# EAGLE design as3320-Vowel-1 (EAGLE 9.6.2)

## Sheet 1 of 5: CEM
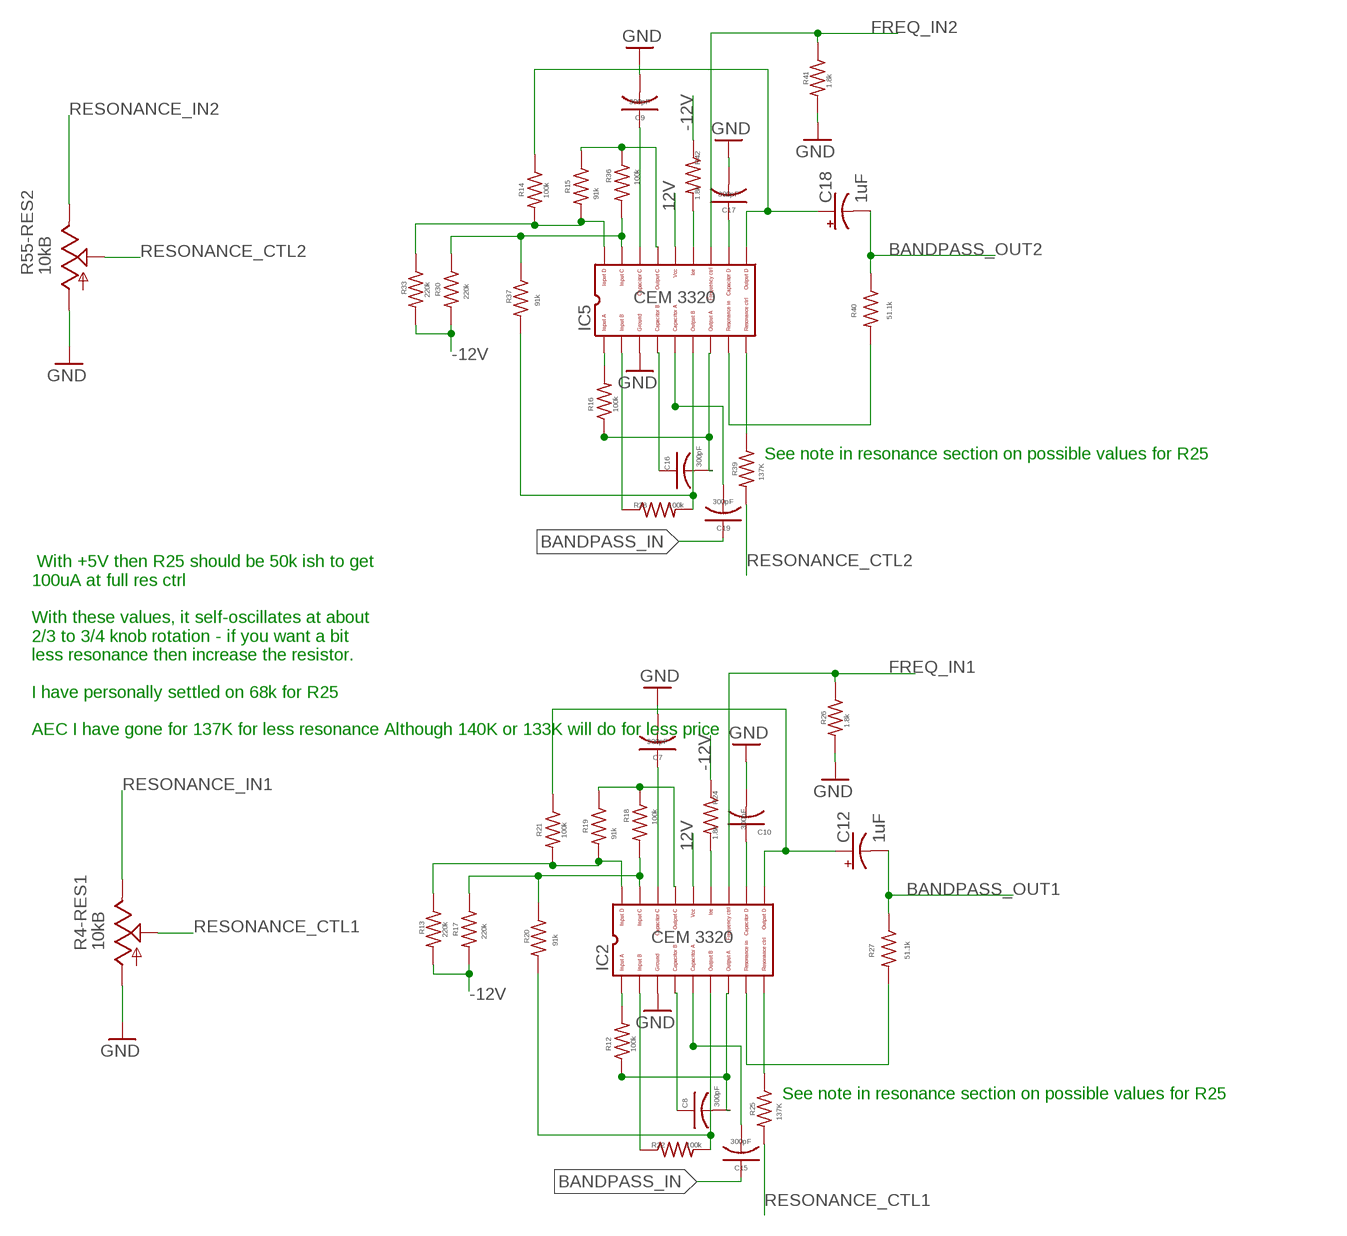
[diagram p0: schematic, sheet 1, part 1 of 2]
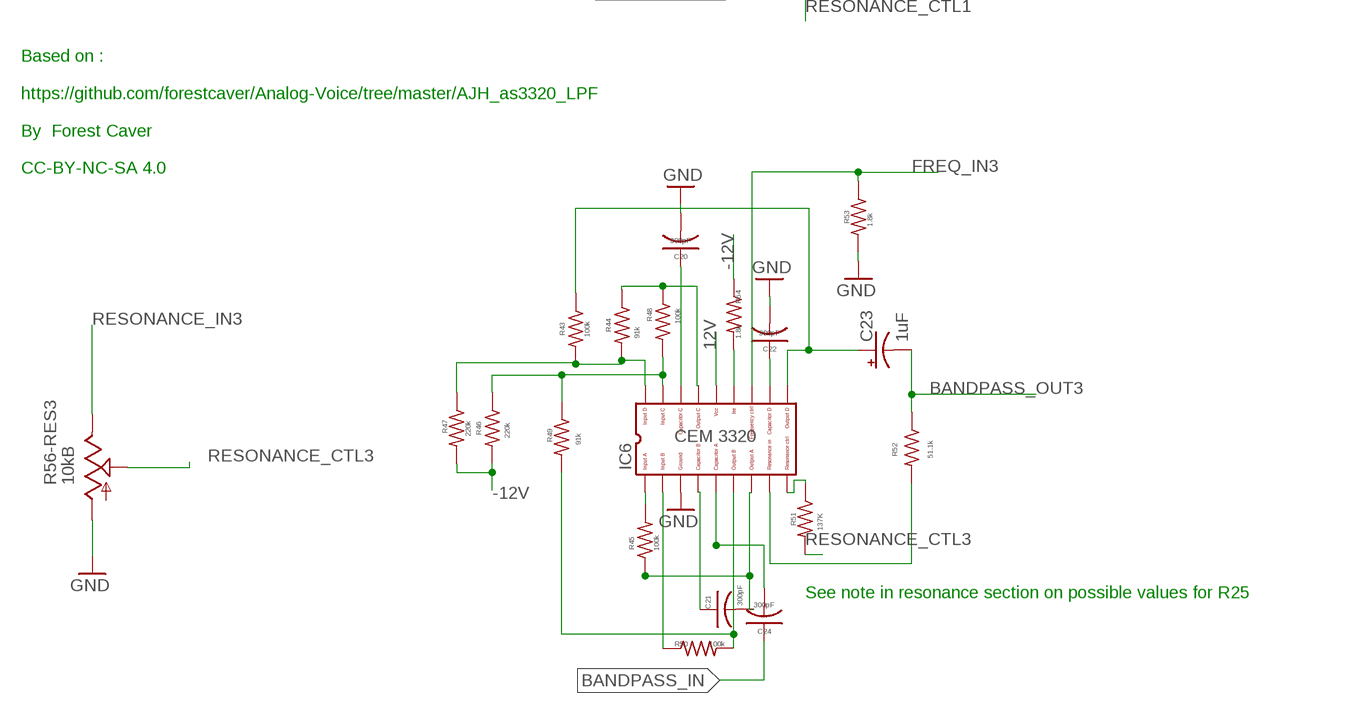
[diagram p1: schematic, sheet 1, part 2 of 2]

### Parts
C7  300pF  C-USC0805K  [C0805K]
C8  300pF  C-USC0805K  [C0805K]
C9  300pF  C-USC0805K  [C0805K]
C10  300pF  GMSN_C-USC0805K  [GMSN_C0805K]
C12  1uF  CPOL-USB  [PANASONIC_B]
C15  300pF  C-USC0805K  [C0805K]
C16  300pF  C-USC0805K  [C0805K]
C17  300pF  C-USC0805K  [C0805K]
C18  1uF  CPOL-USB  [PANASONIC_B]
C19  300pF  C-USC0805K  [C0805K]
C20  300pF  C-USC0805K  [C0805K]
C21  300pF  C-USC0805K  [C0805K]
C22  300pF  C-USC0805K  [C0805K]
C23  1uF  CPOL-USB  [PANASONIC_B]
C24  300pF  GMSN_C-USC0805K  [GMSN_C0805K]
IC2  CEM3320  [DIL18]
IC5  CEM3320  [DIL18]
IC6  CEM3320  [DIL18]
R4-RES1  10kB  POT_USVERTICAL  [ALPS_POT_VERTICAL]
R12  100k  GMSN_R-US_M0805  [GMSN_M0805]
R13  220k  GMSN_R-US_M0805  [GMSN_M0805]
R14  100k  GMSN_R-US_M0805  [GMSN_M0805]
R15  91k  GMSN_R-US_M0805  [GMSN_M0805]
R16  100k  GMSN_R-US_M0805  [GMSN_M0805]
R17  220k  GMSN_R-US_M0805  [GMSN_M0805]
R18  100k  GMSN_R-US_M0805  [GMSN_M0805]
R19  91k  GMSN_R-US_M0805  [GMSN_M0805]
R20  91k  GMSN_R-US_M0805  [GMSN_M0805]
R21  100k  GMSN_R-US_M0805  [GMSN_M0805]
R22  100k  GMSN_R-US_M0805  [GMSN_M0805]
R24  1.8k  GMSN_R-US_M0805  [GMSN_M0805]
R25  137K  GMSN_R-US_M0805  [GMSN_M0805]
R26  1.8k  GMSN_R-US_M0805  [GMSN_M0805]
R27  51.1k  GMSN_R-US_M0805  [GMSN_M0805]
R30  220k  GMSN_R-US_M0805  [GMSN_M0805]
R33  220k  GMSN_R-US_M0805  [GMSN_M0805]
R36  100k  GMSN_R-US_M0805  [GMSN_M0805]
R37  91k  GMSN_R-US_M0805  [GMSN_M0805]
R38  100k  GMSN_R-US_M0805  [GMSN_M0805]
R39  137K  GMSN_R-US_M0805  [GMSN_M0805]
R40  51.1k  GMSN_R-US_M0805  [GMSN_M0805]
R41  1.8k  GMSN_R-US_M0805  [GMSN_M0805]
R42  1.8k  GMSN_R-US_M0805  [GMSN_M0805]
R43  100k  GMSN_R-US_M0805  [GMSN_M0805]
R44  91k  GMSN_R-US_M0805  [GMSN_M0805]
R45  100k  GMSN_R-US_M0805  [GMSN_M0805]
R46  220k  GMSN_R-US_M0805  [GMSN_M0805]
R47  220k  GMSN_R-US_M0805  [GMSN_M0805]
R48  100k  GMSN_R-US_M0805  [GMSN_M0805]
R49  91k  GMSN_R-US_M0805  [GMSN_M0805]
R50  100k  GMSN_R-US_M0805  [GMSN_M0805]
R51  137K  GMSN_R-US_M0805  [GMSN_M0805]
R52  51.1k  GMSN_R-US_M0805  [GMSN_M0805]
R53  1.8k  GMSN_R-US_M0805  [GMSN_M0805]
R54  1.8k  GMSN_R-US_M0805  [GMSN_M0805]
R55-RES2  10kB  POT_USVERTICAL  [ALPS_POT_VERTICAL]
R56-RES3  10kB  POT_USVERTICAL  [ALPS_POT_VERTICAL]

### Nets
12V [power]: IC2.14 IC5.14 IC6.14 ; also sheet 2,3,5
-12V [power]: R13.2 R17.2 R24.1 R30.2 R33.2 R42.1 R46.2 R47.2 R54.1 ; also sheet 2,3,5
BANDPASS_IN: C15.1 C19.1 C24.1 ; also sheet 3
BANDPASS_OUT1: C12.- R27.1 ; also sheet 5
BANDPASS_OUT2: C18.- R40.1 ; also sheet 5
BANDPASS_OUT3: C23.- R52.1 ; also sheet 5
FREQ_IN1: IC2.12 R26.1 ; also sheet 3
FREQ_IN2: IC5.12 R41.1 ; also sheet 3
FREQ_IN3: IC6.12 R53.1 ; also sheet 3
GND [power]: C7.2 C9.2 C10.2 C17.2 C20.2 C22.2 IC2.3 IC5.3 IC6.3 R4-RES1.P$3(A) R26.2 R41.2 R53.2 R55-RES2.P$3(A) R56-RES3.P$3(A) ; also sheet 2,3,4,5
N$2: IC2.17 R17.1 R18.2 R20.1
N$14: IC2.15 R18.1 R19.1
N$16: IC2.18 R13.1 R19.2 R21.2
N$17 [nearfilter]: C12.+ IC2.10 R21.1
N$18 [nearfilter]: C17.1 IC5.11
N$19: C15.2 IC2.5
N$21: IC5.9 R39.1
N$23: C8.2 IC2.7 R12.1
N$24: C8.1 IC2.4
N$25: IC2.2 R22.1
N$26: IC2.6 R20.2 R22.2
N$27: IC2.1 R12.2
N$28 [nearfilter]: IC5.8 R40.2
N$29 [nearfilter]: IC5.13 R42.2
N$30: C9.1 IC5.16
N$31 [nearfilter]: C18.+ IC5.10 R14.1
N$32: C19.2 IC5.5
N$33: C16.2 IC5.7 R16.1
N$34: C16.1 IC5.4
N$35: IC5.2 R38.1
N$36: IC5.6 R37.2 R38.2
N$37: IC5.1 R16.2
N$38: IC5.17 R30.1 R36.2 R37.1
N$40: C7.1 IC2.16
N$41: IC5.15 R15.1 R36.1
N$42: IC5.18 R14.2 R15.2 R33.1
N$43 [nearfilter]: C10.1 IC2.11
N$44: IC2.9 R25.1
N$45 [nearfilter]: C22.1 IC6.11
N$46: IC6.9 R51.1
N$47 [nearfilter]: IC6.8 R52.2
N$48 [nearfilter]: IC6.13 R54.2
N$49: C20.1 IC6.16
N$50 [nearfilter]: C23.+ IC6.10 R43.1
N$51 [nearfilter]: IC2.8 R27.2
N$52: C24.2 IC6.5
N$53: C21.2 IC6.7 R45.1
N$54 [nearfilter]: IC2.13 R24.2
N$56: C21.1 IC6.4
N$57: IC6.2 R50.1
N$58: IC6.6 R49.2 R50.2
N$59: IC6.1 R45.2
N$60: IC6.17 R46.1 R48.2 R49.1
N$61: IC6.15 R44.1 R48.1
N$62: IC6.18 R43.2 R44.2 R47.1
RESONANCE_CTL1: R4-RES1.P$2(S) R25.2
RESONANCE_CTL2: R39.2 R55-RES2.P$2(S)
RESONANCE_CTL3: R51.2 R56-RES3.P$2(S)
RESONANCE_IN1: R4-RES1.P$1(E) ; also sheet 3
RESONANCE_IN2: R55-RES2.P$1(E) ; also sheet 3
RESONANCE_IN3: R56-RES3.P$1(E) ; also sheet 3

### Notes on the sheet
- See note in resonance section on possible values for R25
- With +5V then R25 should be 50k ish to get
  100uA at full res ctrl
  
  With these values, it self-oscillates at about
  2/3 to 3/4 knob rotation - if you want a bit
  less resonance then increase the resistor.
  
  I have personally settled on 68k for R25
  
  AEC I have gone for 137K for less resonance Although 140K or 133K will do for less price
- See note in resonance section on possible values for R25
- Based on :
  
  https://github.com/forestcaver/Analog-Voice/tree/master/AJH_as3320_LPF
  
  By  Forest Caver
  
  CC-BY-NC-SA 4.0
- See note in resonance section on possible values for R25

## Sheet 2 of 5: Power
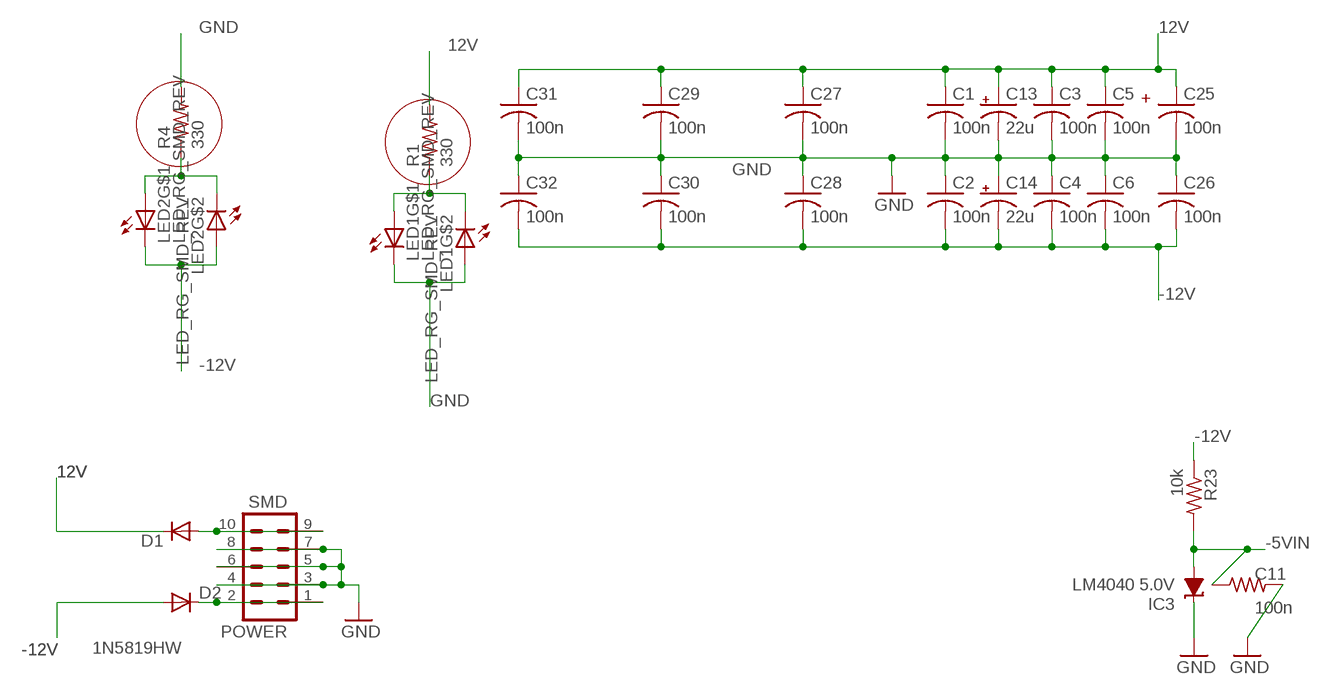
[diagram p2: schematic, sheet 2]

### Parts
C1  100n  C-USC0805K  [C0805K]
C2  100n  C-USC0805K  [C0805K]
C3  100n  C-USC0805K  [C0805K]
C4  100n  C-USC0805K  [C0805K]
C5  100n  C-USC0805K  [C0805K]
C6  100n  C-USC0805K  [C0805K]
C11  100n  GMSN_R-US_M0805  [GMSN_M0805]
C13  22u  CPOL-USB  [PANASONIC_B]
C14  22u  CPOL-USB  [PANASONIC_B]
C25  100n  C-USC0805K  [C0805K]
C26  100n  C-USC0805K  [C0805K]
C27  100n  C-USC0805K  [C0805K]
C28  100n  C-USC0805K  [C0805K]
C29  100n  C-USC0805K  [C0805K]
C30  100n  C-USC0805K  [C0805K]
C31  100n  C-USC0805K  [C0805K]
C32  100n  C-USC0805K  [C0805K]
D1  1N5819HW  DIODE-SOD123  [SOD123]
D2  1N5819HW  DIODE-SOD123  [SOD123]
IC3  LM4040 5.0V  LM4041C12DBZ  [DBZ_R-PDSO-G3]
LED1  LED_RG_SMD_REV  [LSG_T77K]
LED2  LED_RG_SMD_REV  [LSG_T77K]
POWER  SMD  CONN_05X2SHD_SMD  [2X5-SHROUDED_SMD]
R1  330  GMSN_R-US_M0805  [GMSN_M0805]
R4  330  GMSN_R-US_M0805  [GMSN_M0805]
R23  10k  GMSN_R-US_M0805  [GMSN_M0805]

### Nets
12V [power]: C1.1 C3.1 C5.1 C13.+ C25.1 C27.1 C29.1 C31.1 D1.C R1.2 ; also sheet 1,3,5
-5VIN [power]: C11.1 IC3.2(A) R23.2 ; also sheet 4
-12V [power]: C2.2 C4.2 C6.2 C14.- C26.2 C28.2 C30.2 C32.2 D2.A LED2.1(C) LED2.4(A) R23.1 ; also sheet 1,3,5
-12V-P: D2.C POWER.1 POWER.2
GND [power]: C1.2 C2.1 C3.2 C4.1 C5.2 C6.1 C11.2 C13.- C14.+ C25.2 C26.1 C27.2 C28.1 C29.2 C30.1 C31.2 C32.1 IC3.1(C) LED1.1(C) LED1.4(A) POWER.3 POWER.4 POWER.5 POWER.6 POWER.7 POWER.8 R4.2 ; also sheet 1,3,4,5
N$6: D1.A POWER.9 POWER.10
N$74: LED2.2(A) LED2.3(C) R4.1
N$75: LED1.2(A) LED1.3(C) R1.1

### Notes on the sheet
- +

## Sheet 3 of 5: Input
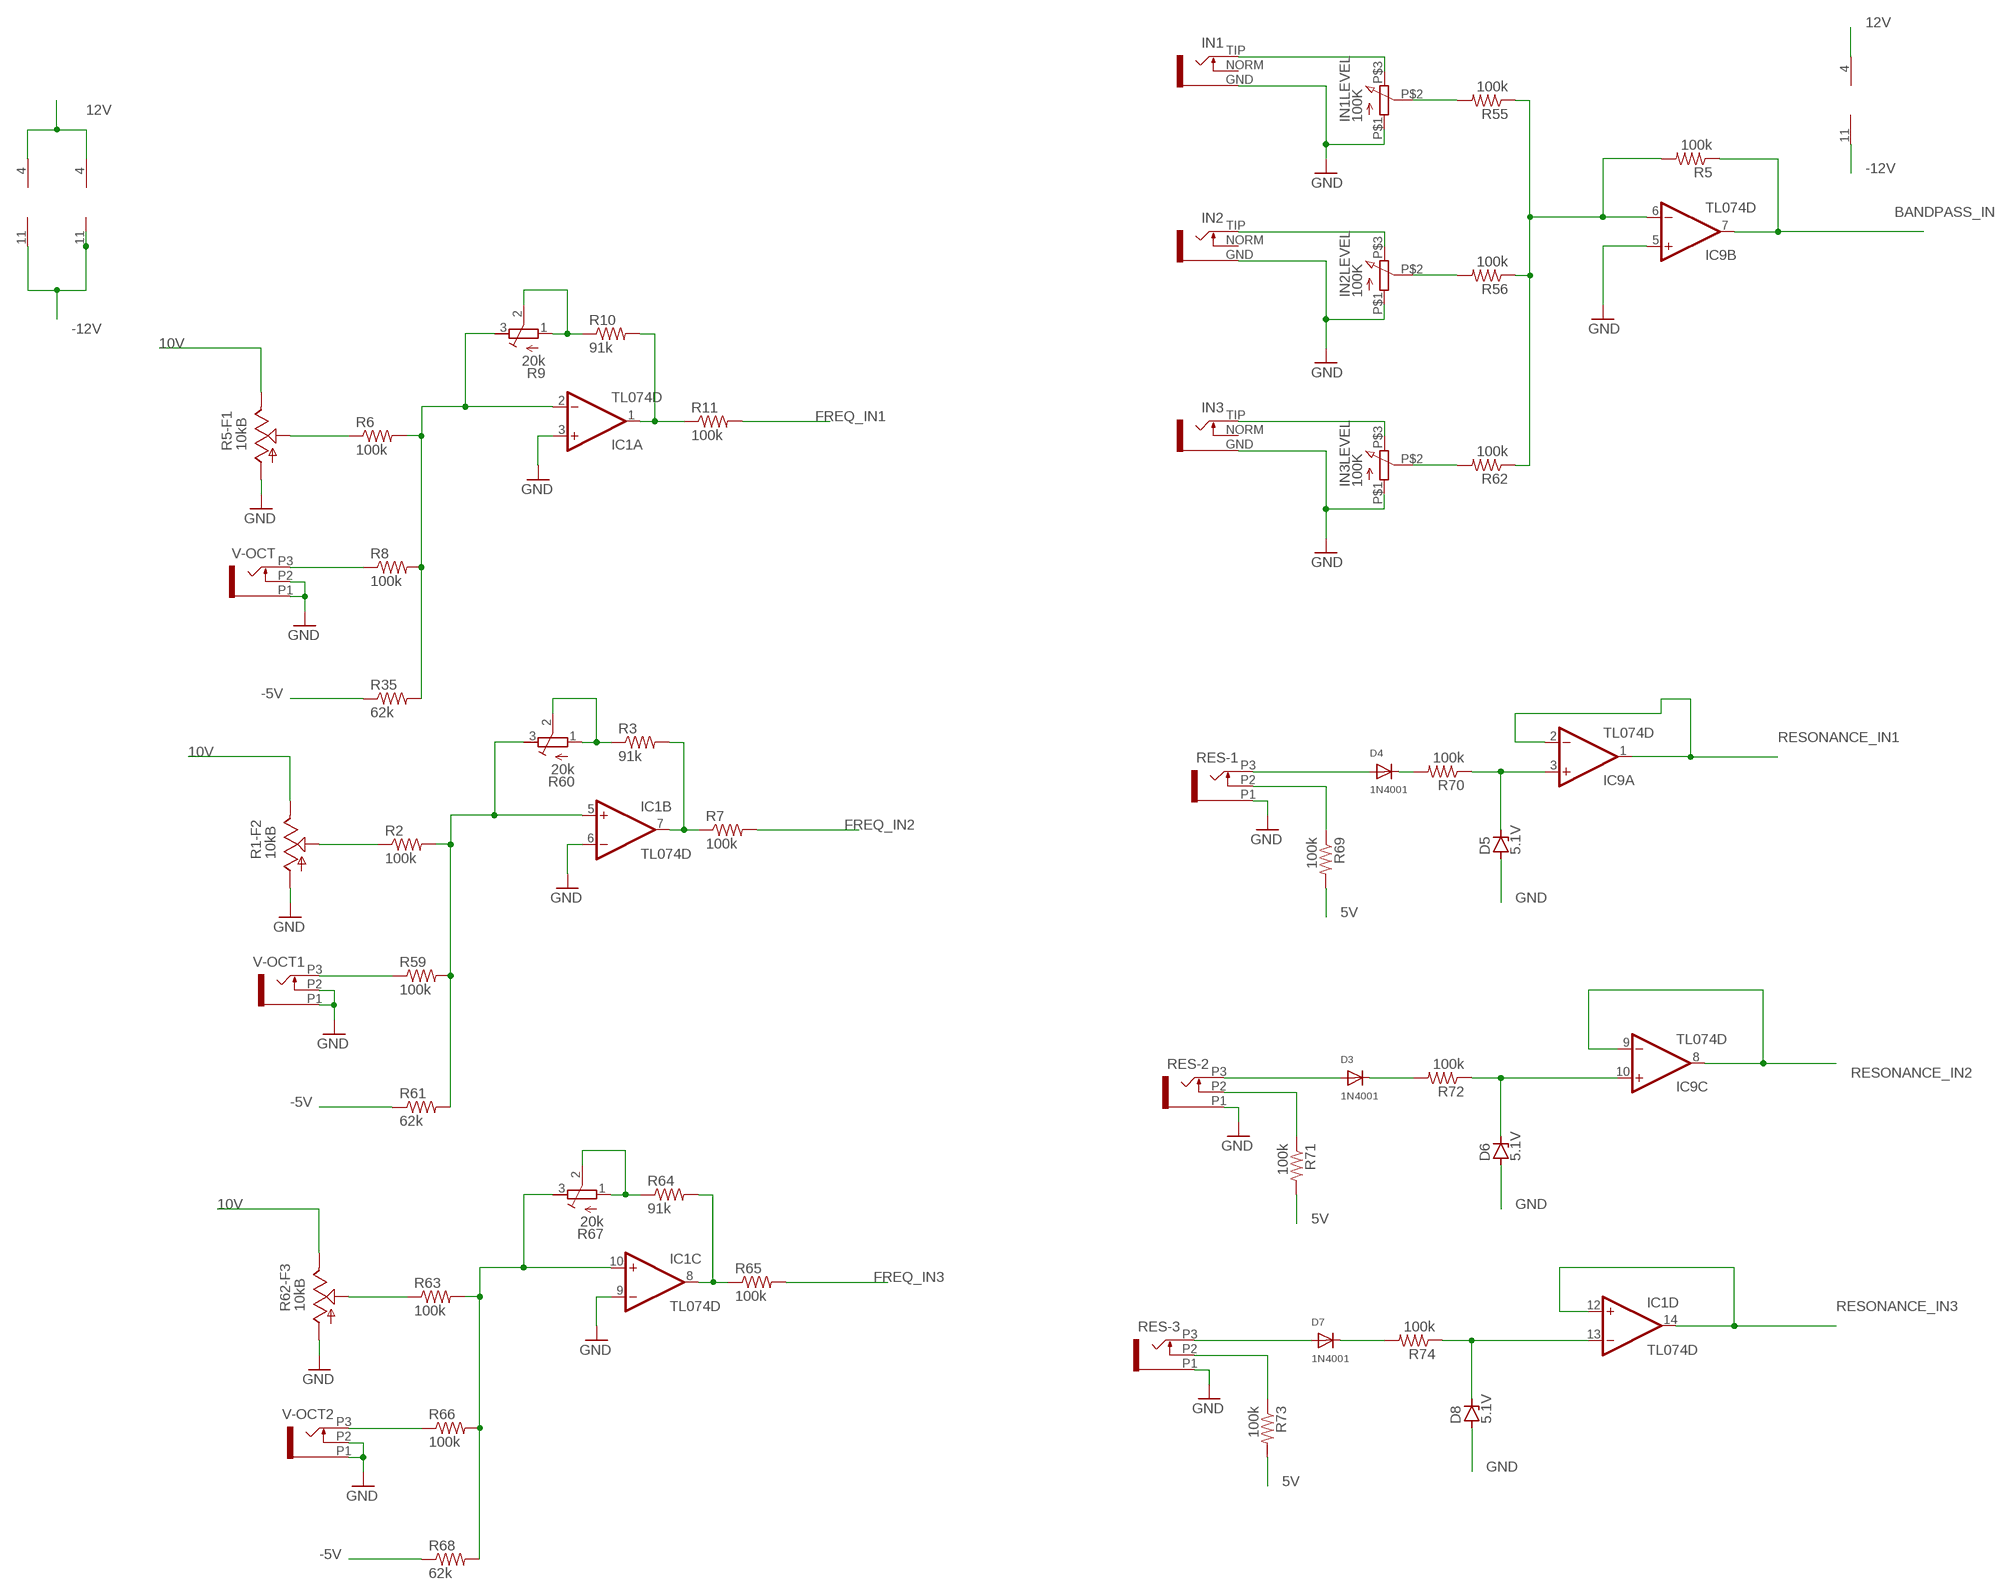
[diagram p3: schematic, sheet 3]

### Parts
D3  1N4001  DIODESMA  [SMADIODE]
D4  1N4001  DIODESMA  [SMADIODE]
D5  5.1V  ZENER-DIODESOT23  [SOT23]
D6  5.1V  ZENER-DIODESOT23  [SOT23]
D7  1N4001  DIODESMA  [SMADIODE]
D8  5.1V  ZENER-DIODESOT23  [SOT23]
IC1  TL074D  [SO14]
IC4  TL074D  [SO14]
IC9  TL074D  [SO14]
IN1  S_JACK  [S_JACK]
IN1LEVEL  100K  9MMPOT  [POT]
IN2  S_JACK  [S_JACK]
IN2LEVEL  100K  9MMPOT  [POT]
IN3  S_JACK  [S_JACK]
IN3LEVEL  100K  9MMPOT  [POT]
R1-F2  10kB  POT_USVERTICAL  [ALPS_POT_VERTICAL]
R2  100k  GMSN_R-US_M0805  [GMSN_M0805]
R3  91k  GMSN_R-US_M0805  [GMSN_M0805]
R5  100k  GMSN_R-US_M0805  [GMSN_M0805]
R5-F1  10kB  POT_USVERTICAL  [ALPS_POT_VERTICAL]
R6  100k  GMSN_R-US_M0805  [GMSN_M0805]
R7  100k  GMSN_R-US_M0805  [GMSN_M0805]
R8  100k  GMSN_R-US_M0805  [GMSN_M0805]
R9  20k  R-TRIMM3296X  [RTRIM3296X]
R10  91k  GMSN_R-US_M0805  [GMSN_M0805]
R11  100k  GMSN_R-US_M0805  [GMSN_M0805]
R35  62k  GMSN_R-US_M0805  [GMSN_M0805]
R55  100k  R-US_R0805  [R0805]
R56  100k  R-US_R0805  [R0805]
R59  100k  GMSN_R-US_M0805  [GMSN_M0805]
R60  20k  R-TRIMM3296X  [RTRIM3296X]
R61  62k  GMSN_R-US_M0805  [GMSN_M0805]
R62  100k  R-US_R0805  [R0805]
R62-F3  10kB  POT_USVERTICAL  [ALPS_POT_VERTICAL]
R63  100k  GMSN_R-US_M0805  [GMSN_M0805]
R64  91k  GMSN_R-US_M0805  [GMSN_M0805]
R65  100k  GMSN_R-US_M0805  [GMSN_M0805]
R66  100k  GMSN_R-US_M0805  [GMSN_M0805]
R67  20k  R-TRIMM3296X  [RTRIM3296X]
R68  62k  GMSN_R-US_M0805  [GMSN_M0805]
R69  100k  R-US_R0805  [R0805]
R70  100k  GMSN_R-US_M0805  [GMSN_M0805]
R71  100k  R-US_R0805  [R0805]
R72  100k  GMSN_R-US_M0805  [GMSN_M0805]
R73  100k  R-US_R0805  [R0805]
R74  100k  R-US_R0805  [R0805]
RES-1  PJ301_THONKICONN6  [WQP_PJ_301M6]
RES-2  PJ301_THONKICONN6  [WQP_PJ_301M6]
RES-3  PJ301_THONKICONN6  [WQP_PJ_301M6]
V-OCT  PJ301_THONKICONN6  [WQP_PJ_301M6]
V-OCT1  PJ301_THONKICONN6  [WQP_PJ_301M6]
V-OCT2  PJ301_THONKICONN6  [WQP_PJ_301M6]

### Nets
5V [power]: R69.2 R71.2 R73.2 ; also sheet 4
10V [power]: R1-F2.P$1(E) R5-F1.P$1(E) R62-F3.P$1(E) ; also sheet 4
12V [power]: IC1.4(P:V+) IC4.4(P:V+) IC9.4(P:V+) ; also sheet 1,2,5
-5V [power]: R35.1 R61.1 R68.1 ; also sheet 4
-12V [power]: IC1.11(P:V-) IC4.11(P:V-) IC9.11(P:V-) ; also sheet 1,2,5
BANDPASS_IN: IC9.7(B:OUT) R5.1 ; also sheet 1
FREQ_IN1: R11.2 ; also sheet 1
FREQ_IN2: R7.2 ; also sheet 1
FREQ_IN3: R65.2 ; also sheet 1
GND [power]: D5.1(A) D6.1(A) D8.1(A) IC1.3(A:+IN) IC1.6(B:-IN) IC1.9(C:-IN) IC9.5(B:+IN) IN1.GND IN1LEVEL.P$1 IN2.GND IN2LEVEL.P$1 IN3.GND IN3LEVEL.P$1 R1-F2.P$3(A) R5-F1.P$3(A) R62-F3.P$3(A) RES-1.P1 RES-2.P1 RES-3.P1 V-OCT1.P1 V-OCT1.P2 V-OCT2.P1 V-OCT2.P2 V-OCT.P1 V-OCT.P2 ; also sheet 1,2,4,5
N$3: IC1.7(B:OUT) R3.2 R7.1
N$4: R5-F1.P$2(S) R6.1
N$5: R1-F2.P$2(S) R2.1
N$7: IC1.2(A:-IN) R6.2 R8.2 R9.3(A) R35.2
N$8: IC1.1(A:OUT) R10.2 R11.1
N$9: R71.1 RES-2.P2
N$10: R8.1 V-OCT.P3
N$12: IC1.5(B:+IN) R2.2 R59.2 R60.3(A) R61.2
N$55: R9.1(E) R9.2(S) R10.1
N$67: R59.1 V-OCT1.P3
N$68: R3.1 R60.1(E) R60.2(S)
N$69: IC1.8(C:OUT) R64.2 R65.1
N$70: R62-F3.P$2(S) R63.1
N$71: IC1.10(C:+IN) R63.2 R66.2 R67.3(A) R68.2
N$72: R66.1 V-OCT2.P3
N$73: R64.1 R67.1(E) R67.2(S)
N$76: IN1.TIP IN1LEVEL.P$3
N$77: IN2.TIP IN2LEVEL.P$3
N$78: D3.A RES-2.P3
N$79: IN1LEVEL.P$2 R55.2
N$80: IN2LEVEL.P$2 R56.2
N$81: R69.1 RES-1.P2
N$82: IN3.TIP IN3LEVEL.P$3
N$83: IN3LEVEL.P$2 R62.2
N$84: IC9.6(B:-IN) R5.2 R55.1 R56.1 R62.1
N$85: D3.C R72.2
N$86: D4.A RES-1.P3
N$87: D4.C R70.2
N$88: D5.3(C) IC9.3(A:+IN) R70.1
N$89: D6.3(C) IC9.10(C:+IN) R72.1
N$90: R73.1 RES-3.P2
N$91: D7.A RES-3.P3
N$92: D7.C R74.2
N$93: D8.3(C) IC1.13(D:-IN) R74.1
RESONANCE_IN1: IC9.1(A:OUT) IC9.2(A:-IN) ; also sheet 1
RESONANCE_IN2: IC9.8(C:OUT) IC9.9(C:-IN) ; also sheet 1
RESONANCE_IN3: IC1.12(D:+IN) IC1.14(D:OUT) ; also sheet 1
Unconnected: IC4.12(D:+IN) IC4.13(D:-IN) IC4.14(D:OUT) IC9.12(D:+IN) IC9.13(D:-IN) IC9.14(D:OUT) IN1.NORM IN2.NORM IN3.NORM

## Sheet 4 of 5: Ref
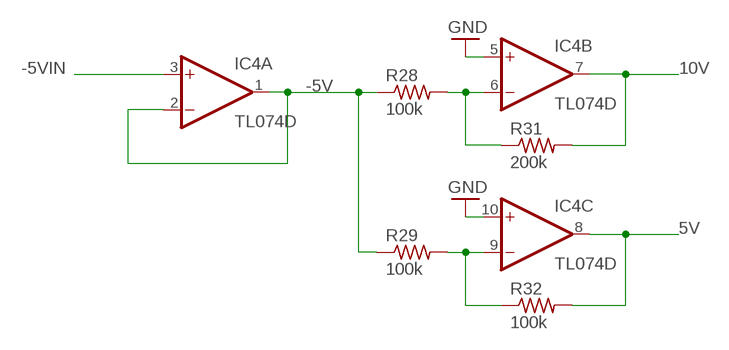
[diagram p4: schematic, sheet 4]

### Parts
R28  100k  GMSN_R-US_M0805  [GMSN_M0805]
R29  100k  GMSN_R-US_M0805  [GMSN_M0805]
R31  200k  GMSN_R-US_M0805  [GMSN_M0805]
R32  100k  GMSN_R-US_M0805  [GMSN_M0805]

### Nets
5V [power]: IC4.8(C:OUT) R32.2 ; also sheet 3
10V [power]: IC4.7(B:OUT) R31.2 ; also sheet 3
-5V [power]: IC4.1(A:OUT) IC4.2(A:-IN) R28.1 R29.1 ; also sheet 3
-5VIN [power]: IC4.3(A:+IN) ; also sheet 2
GND [power]: IC4.5(B:+IN) IC4.10(C:+IN) ; also sheet 1,2,3,5
N$13: IC4.9(C:-IN) R29.2 R32.1
N$15: IC4.6(B:-IN) R28.2 R31.1

## Sheet 5 of 5: Output
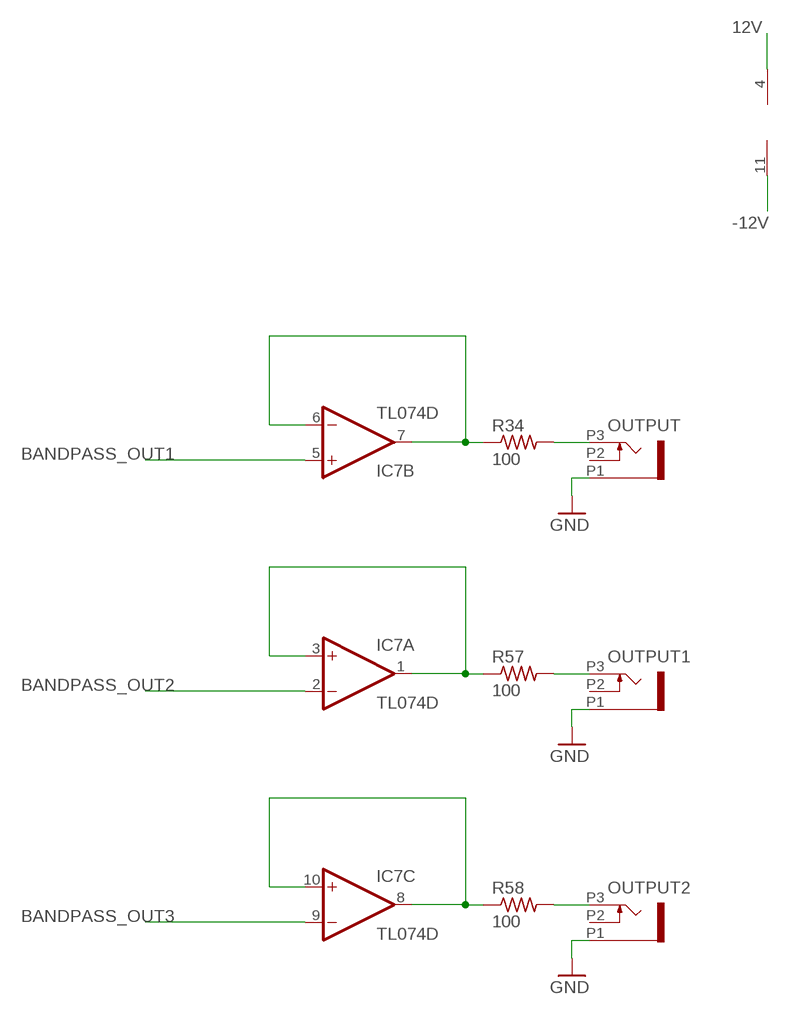
[diagram p5: schematic, sheet 5]

### Parts
IC7  TL074D  [SO14]
OUTPUT  PJ301_THONKICONN6  [WQP_PJ_301M6]
OUTPUT1  PJ301_THONKICONN6  [WQP_PJ_301M6]
OUTPUT2  PJ301_THONKICONN6  [WQP_PJ_301M6]
R34  100  GMSN_R-US_M0805  [GMSN_M0805]
R57  100  GMSN_R-US_M0805  [GMSN_M0805]
R58  100  GMSN_R-US_M0805  [GMSN_M0805]

### Nets
12V [power]: IC7.4(P:V+) ; also sheet 1,2,3
-12V [power]: IC7.11(P:V-) ; also sheet 1,2,3
BANDPASS_OUT1: IC7.5(B:+IN) ; also sheet 1
BANDPASS_OUT2: IC7.2(A:-IN) ; also sheet 1
BANDPASS_OUT3: IC7.9(C:-IN) ; also sheet 1
GND [power]: OUTPUT1.P1 OUTPUT2.P1 OUTPUT.P1 ; also sheet 1,2,3,4
N$1: IC7.6(B:-IN) IC7.7(B:OUT) R34.1
N$11: OUTPUT.P3 R34.2
N$63: IC7.1(A:OUT) IC7.3(A:+IN) R57.1
N$64: OUTPUT1.P3 R57.2
N$65: IC7.8(C:OUT) IC7.10(C:+IN) R58.1
N$66: OUTPUT2.P3 R58.2
Unconnected: IC7.12(D:+IN) IC7.13(D:-IN) IC7.14(D:OUT) OUTPUT1.P2 OUTPUT2.P2 OUTPUT.P2

## Library data of the parts
C1-C9 C15-C17 C19-C22 C25-C32 = rcl:C-US: CAPACITOR, American symbol; SPICEPREFIX: C
C10 C24 = Pure VCF:GMSN_C-US: CAPACITOR, American symbol
C11 R1-R3 R5-R8 R10-R54 R57-R59 R61 R63-R66 R68 R70 R72 = Pure VCF:GMSN_R-US_: RESISTOR, American symbol
C12 C18 C23 = rcl:CPOL-US: POLARIZED CAPACITOR, American symbol; SPICEPREFIX: C
C13 C14 = rcl:CPOL-US: POLARIZED CAPACITOR, American symbol
D1 D2 = diode:DIODE-: DIODE
D3 D4 D7 = GMSN:DIODE: Diode SMADIODE - SMA Surface Mount Package 20V 1A Schottky Diode Digikey: 641-1014-6-ND DO-1N4148 - Through Hole Small Current Diode SOD-123 20V 1 A (.5mV Vf) Schottky Diode - Digikey: MBRX120TPMSCT-ND SOD-323 10V 570mA (.38mV Vf, 3ns) Schottky Diode - Digikey: ZLLS410CT-ND SOD-523 30V 30mA Schottky Diode (RB751S-40TE61) - Digikey: RB751S-40TE61CT-ND SOT23-R/W - SOT23 Package (R = Solder Paste/Reflow Ovens, W = Hand-Soldering) BAT54Film 40V 300mA - Digikey: 497-7162-1-ND
D5 D6 D8 = diode:ZENER-DIODE: Z-Diode; RS-PART: 816-7962
IC1 IC4 IC7 = linear:TL074: OP AMP
IC2 IC5 IC6 = CEM:CEM3320: CEM 3330 VCF
IC3 = texas:LM4041: PRECISION MICROPOWER SHUNT VOLTAGE REFERENCE Source: http://focus.ti.com/lit/ds/slcs146e/slcs146e.pdf
IC9 = GMSN:TL074: OP AMP
IN1-IN3 = INSTRUO:S_JACK
IN1LEVEL IN2LEVEL IN3LEVEL = GMSN:9MMPOT
LED1 = INSTRUO:LED_RG_SMD_REV: http://uk.rs-online.com/web/p/visible-leds/7193196/; RS-PART: 915-4828
LED2 = INSTRUO:LED_RG_SMD_REV: http://uk.rs-online.com/web/p/visible-leds/7193196/
OUTPUT OUTPUT1 OUTPUT2 RES-1-RES-3 V-OCT V-OCT1 V-OCT2 = og-pj301_variations:PJ301_THONKICONN
POWER = SparkFun-Connectors:CONN_05X2: Multi connection point. Often used as Generic Header-pin footprint for 0.1 inch spaced/style header connections For AVR SPI programming port, see special device with nice symbol: "AVR_SPI_PROG_5x2.dev" You can populate with any combo of single row headers, but if you'd like an exact match, check these: 2x5 AVR ICSP Male Header <https://www.sparkfun.com/products/778> (PRT-00778) 2x5 Pin Shrouded Header <https://www.sparkfun.com/products/8506> (PRT-08506) On any of the 0.1 inch spaced packages, you can populate with these: Break Away Headers - Straight <https://www.sparkfun.com/products/116> (PRT-00116) Break Away Male Headers - Right Angle <https://www.sparkfun.com/products/553> (PRT-00553) Female Headers <https://www.sparkfun.com/products/115> (PRT-00115) Break Away Headers - Machine Pin <https://www.sparkfun.com/products/117> (PRT-00117) Break Away Female Headers - Swiss Machine Pin <https://www.sparkfun.com/products/743> (PRT-00743) Special note: the shrouded connector mates well with our 5x2 ribbon cables: 2x5 Pin IDC Ribbon Cable <https://www.sparkfun.com/products/8535> (PRT-08535); PROD_ID: CONN-09508; RS-PART: 828-1783
R1-F2 R4-RES1 R5-F1 R55-RES2 R56-RES3 R62-F3 = og-pots:POT_US
R4 = Pure VCF:GMSN_R-US_: RESISTOR, American symbol; RS-PART: 915-4828
R9 R60 R67 = rcl:R-TRIMM: Trimm resistor
R55 R56 R62 R69 R71 R73 R74 = GMSN:R-US_: RESISTOR, American symbol

## Net classes
0 default: width 0.152 mm
1 power: width 0.406 mm
2 nearfilter: width 0.152 mm

## Board
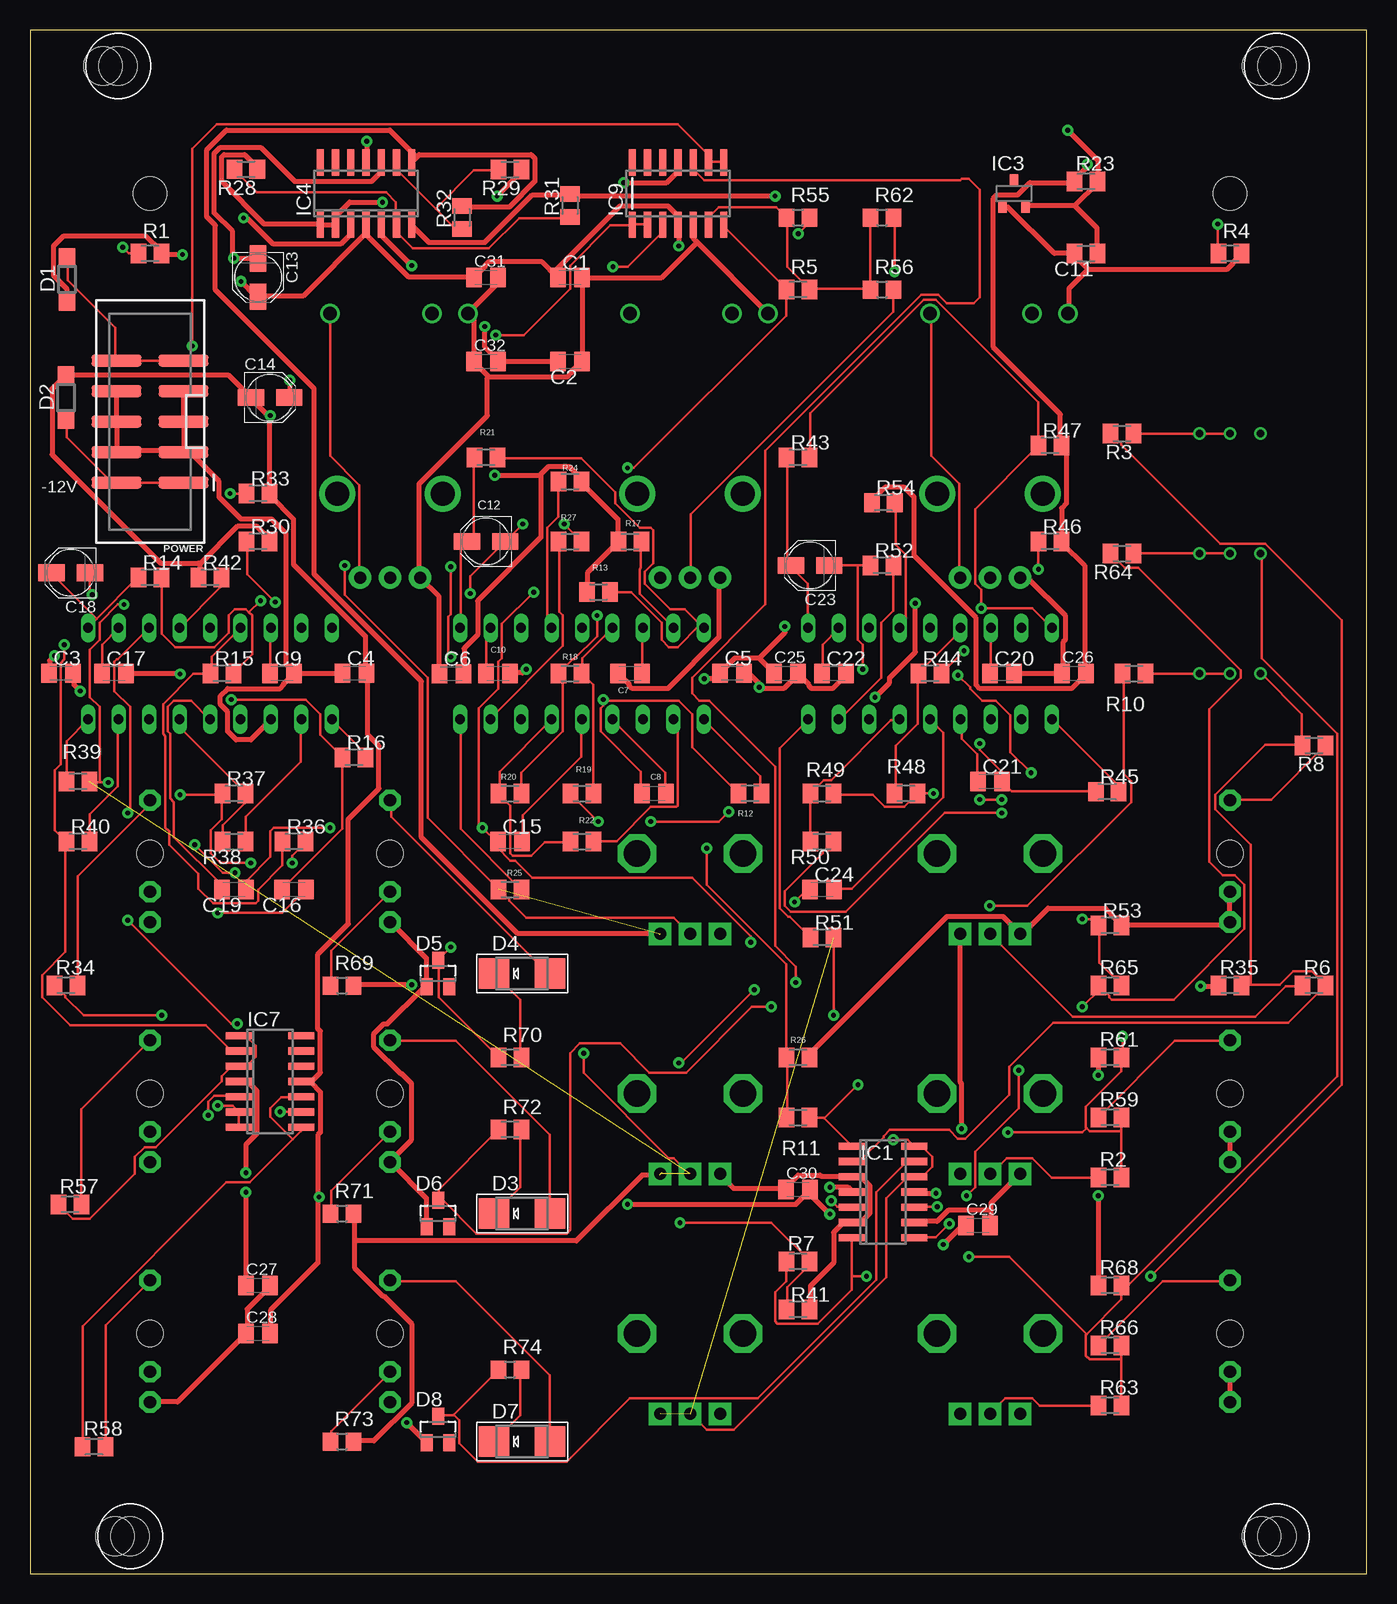
[diagram p6: board, top side]
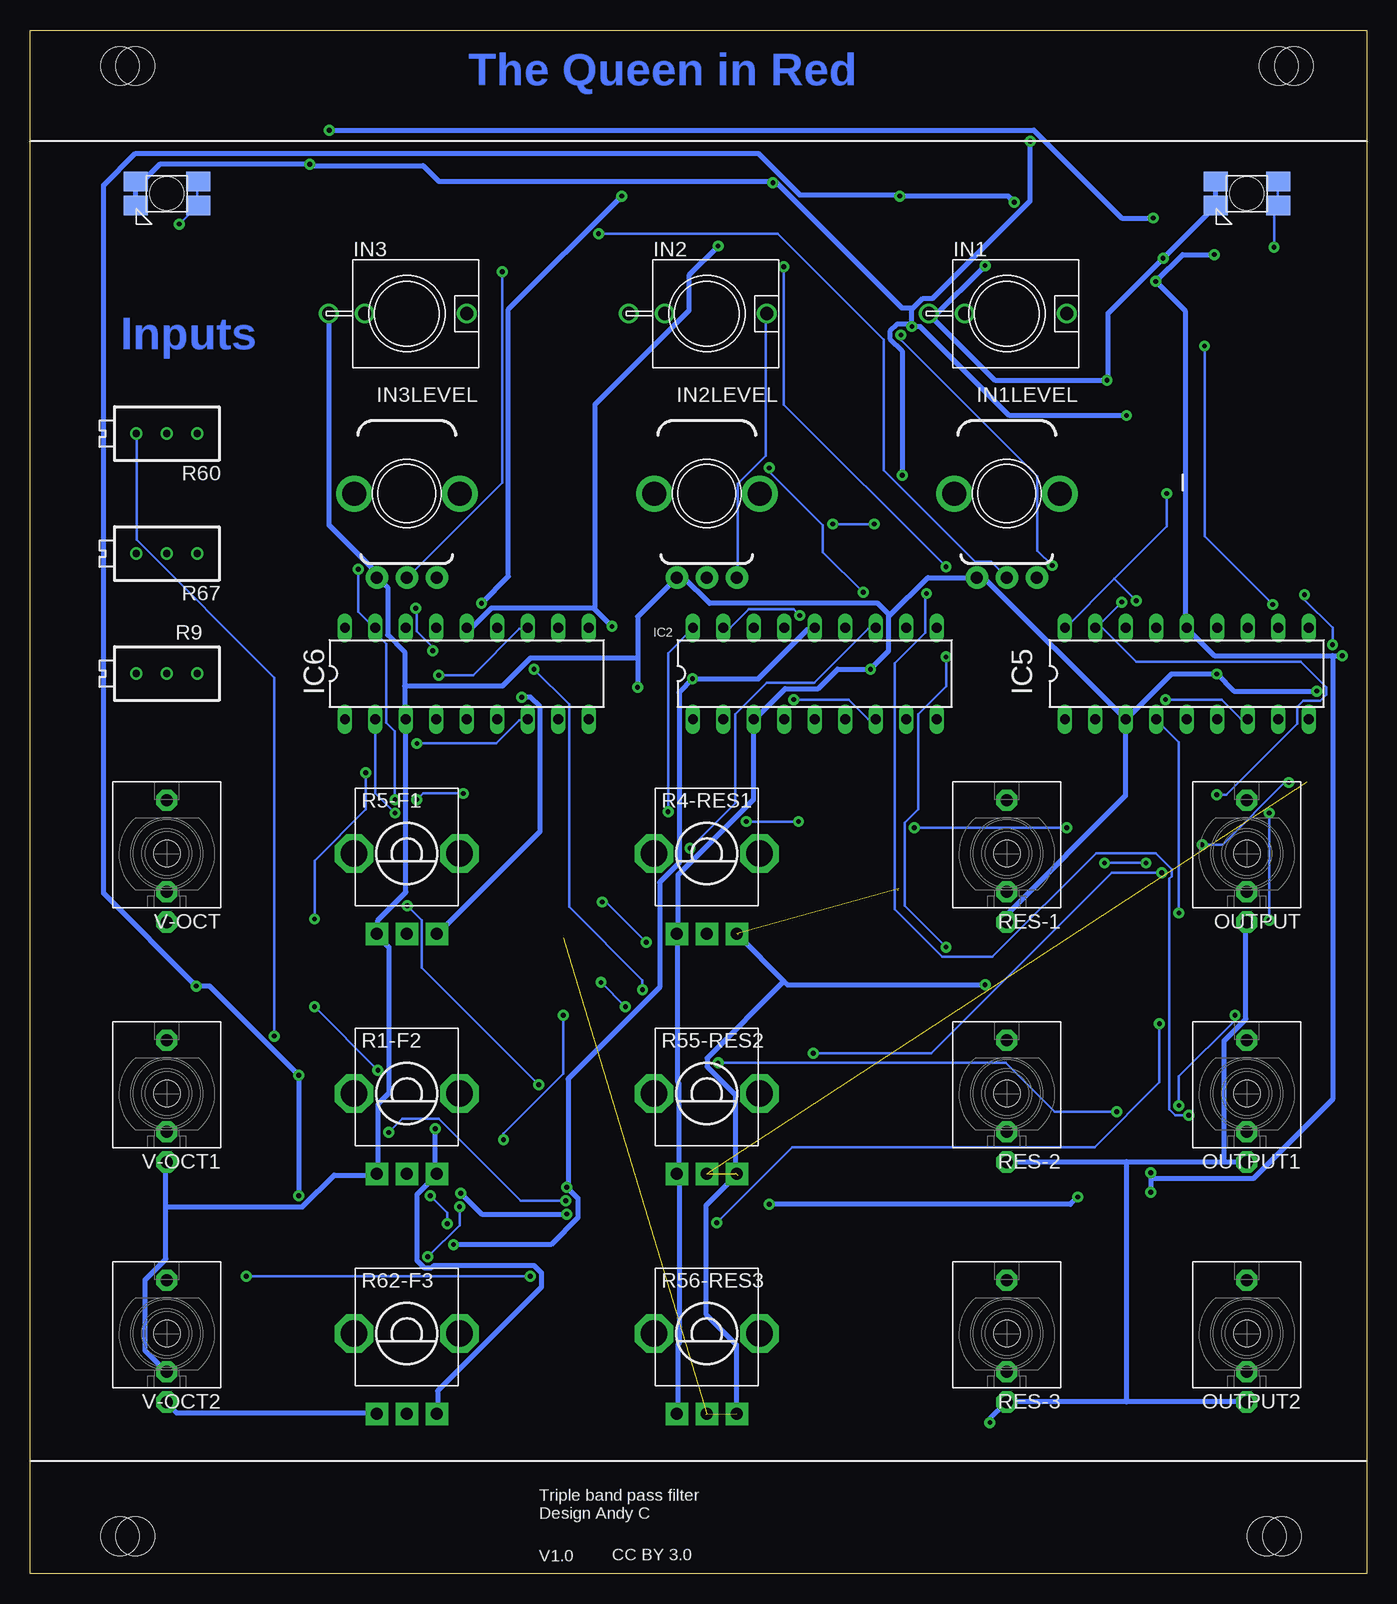
[diagram p7: board, bottom side, seen from below]

Size 111.4 x 128.63 mm. Coordinates in mm from the lower left corner, seen from the top.
Outline: 111.4,0 111.4,128.63 0,128.63 0,0 111.4,0
Copper layers (1*16): Top 0.035mm / dielectric 1.5mm / Bottom 0.035mm
Design rules "Mutable_PCBCart-Standard": minimum track width 8mil, minimum drill 0.4mm, track to track 8mil, track to pad 8mil, pad to pad 8mil, via to via 8mil, smd to smd 8mil, copper to edge 20mil, drill to drill 8mil, minimum pad ring 8mil, minimum via ring 10mil, stop-mask expansion 3mil, vias tented up to drill 25mil, thermal gap 8mil

### Footprints (pad centres in the part's own frame; a part is rotated, then mirrored left to right if it is on the bottom)
C0805K = smd 1.3 x 1.6: 1 -1,0; 2 1,0
GMSN_C0805K = smd 1.3 x 1.6: 1 -1,0; 2 1,0
GMSN_M0805 = smd 1.3 x 1.6: 1 -0.95,0; 2 0.95,0
PANASONIC_B = smd 2.2 x 1.4: + 1.6,0; - -1.6,0
SOD123 = smd 1.4 x 1.4: A 1.9,0; C -1.9,0
SMADIODE = smd 2.54 x 2.54: A 2.349,0; C -2.349,0
SOT23 = smd 1 x 1.4: 1 -0.95,-1.1; 2 0.95,-1.1; 3 0,1.1
SO14 = smd 0.6 x 2.2: 1 -3.81,-2.6; 2 -2.54,-2.6; 3 -1.27,-2.6; 4 0,-2.6; 5 1.27,-2.6; 6 2.54,-2.6; 7 3.81,-2.6; 8 3.81,2.6; 9 2.54,2.6; 10 1.27,2.6; 11 0,2.6; 12 -1.27,2.6; 13 -2.54,2.6; 14 -3.81,2.6
DIL18 = drill 0.813 long: 1 -10.16,-3.81; 2 -7.62,-3.81; 3 -5.08,-3.81; 4 -2.54,-3.81; 5 0,-3.81; 6 2.54,-3.81; 7 5.08,-3.81; 8 7.62,-3.81; 9 10.16,-3.81; 10 10.16,3.81; 11 7.62,3.81; 12 5.08,3.81; 13 2.54,3.81; 14 0,3.81; 15 -2.54,3.81; 16 -5.08,3.81; 17 -7.62,3.81; 18 -10.16,3.81
DBZ_R-PDSO-G3 = smd 0.7 x 1: 1 -0.95,-1.1; 2 0.95,-1.1; 3 0,1.1
S_JACK = drill 1.1: GND 0,-6.5; NORM 0,-3.5; TIP 0,5
POT = drill 1 pad 1.88: P$1 -2.5,-7; P$2 0,-7; P$3 2.5,-7 | drill 2 pad 2.68: P$4 -4.4,0; P$5 4.4,0
LSG_T77K = smd 2 x 1.6: 1 -2.6,-1; 2 2.6,-1; 3 2.6,1; 4 -2.6,1 | hole 2.8: 0,0
WQP_PJ_301M6 = drill 1.016 pad 1.778 octagon: P1 0,-5.715; P2 0,-3.175; P3 0,4.445 | hole 2.2: 0,0
2X5-SHROUDED_SMD = smd 4.15 x 1: 1 -2.794,5.08; 2 2.794,5.08; 3 -2.794,2.54; 4 2.794,2.54; 5 -2.794,0; 6 2.794,0; 7 -2.794,-2.54; 8 2.794,-2.54; 9 -2.794,-5.08; 10 2.794,-5.08
ALPS_POT_VERTICAL = drill 1 pad 1.88 square: P$1 -2.5,6.7; P$2 0,6.7; P$3 2.5,6.7 | drill 2.2 pad 3.175 octagon: P$4 -4.4,0; P$5 4.4,0
RTRIM3296X = drill 0.61: 1 0,-2.54; 2 0,0; 3 0,2.54
R0805 = smd 1.3 x 1.5: 1 -0.95,0; 2 0.95,0
MOUNTING_HOLE = hole 3.2: 0,0; 0,1.27

### Placement (x,y rotation side)
C1  45,108 0 top
C2  45,101 180 top
C3  2.59,75.03 0 top
C4  27.05,75.03 0 top
C5  58.51,75.03 0 top
C6  35.12,74.98 0 top
C7  50,75 180 top
C8  52,65 180 top
C9  21,75 0 top
C10  39,75 0 top
C11  88,110 180 top
C12  38,86 180 top
C13  19,108 270 top
C14  20,98 0 top
C15  40,61 0 top
C16  22,57 180 top
C17  7,75 0 top
C18  3.39,83.39 180 top
C19  17,57 180 top
C20  81,75 0 top
C21  80,66 0 top
C22  67,75 0 top
C23  65,84 180 top
C24  66,57 0 top
C25  63,75 0 top
C26  87,75 0 top
C27  19,24 0 top
C28  19,20 0 top
C29  79,29 0 top
C30  64,32 0 top
C31  38,108 0 top
C32  38,101 0 top
D1  3.08,107.86 90 top
D2  3,98 90 top
D3  41,30 0 top
D4  41,50 0 top
D5  34,50 0 top
D6  34,30 0 top
D7  41,11 0 top
D8  34,12 0 top
IC1  71.09,31.79 270 top
IC2  46,75 0 bottom
IC3  82,115 0 top
IC4  28,115 0 top
IC5  15,75 0 bottom
IC6  75,75 0 bottom
IC7  20,41 270 top
IC9  54,115 0 top
IN1  30,105 270 bottom
IN1LEVEL  30,90 0 bottom
IN2  55,105 270 bottom
IN2LEVEL  55,90 0 bottom
IN3  80,105 270 bottom
IN3LEVEL  80,90 0 bottom
LED1  10,115 0 bottom
LED2  100,115 0 bottom
OUTPUT  10,60 0 bottom
OUTPUT1  10,40 0 bottom
OUTPUT2  10,20 0 bottom
POWER  10,96 180 top
R1  10,110 0 top
R1-F2  80,40 180 bottom
R2  90,33 0 top
R3  91,95 180 top
R4  100,110 0 top
R4-RES1  55,60 180 bottom
R5  64,107 0 top
R5-F1  80,60 180 bottom
R6  107,49 0 top
R7  64,26 0 top
R8  107,69 180 top
R9  100,75 90 bottom
R10  92,75 180 top
R11  64,38 180 top
R12  60,65 0 top
R13  47.37,81.8 180 top
R14  10,83 0 top
R15  16,75 0 top
R16  27,68 0 top
R17  50,86 180 top
R18  45,75 180 top
R19  46,65 180 top
R20  40,65 180 top
R21  38,93 0 top
R22  46,61 180 top
R23  88,116 0 top
R24  45,91 180 top
R25  40,57 180 top
R26  64,43 0 top
R27  45,86 180 top
R28  17.98,117.03 180 top
R29  40,117 180 top
R30  19,86 0 top
R31  45,114 90 top
R32  36,113 90 top
R33  19,90 0 top
R34  3,49 0 top
R35  100,49 0 top
R36  22,61 0 top
R37  17,65 0 top
R38  17,61 180 top
R39  4,66 0 top
R40  4,61 0 top
R41  64,22 0 top
R42  15,83 0 top
R43  64,93 0 top
R44  75,75 0 top
R45  89.77,65.15 0 top
R46  85,86 0 top
R47  85,94 0 top
R48  73,65 0 top
R49  66,65 180 top
R50  66,61 180 top
R51  66,53 0 top
R52  71,84 0 top
R53  90,54 0 top
R54  71.12,89.24 0 top
R55  64,113 0 top
R55-RES2  55,40 180 bottom
R56  71,107 0 top
R56-RES3  55,20 180 bottom
R57  3.33,30.75 0 top
R58  5.33,10.57 0 top
R59  90,38 0 top
R60  100,95 90 bottom
R61  90,43 0 top
R62  71,113 0 top
R62-F3  80,20 180 bottom
R63  90,14 0 top
R64  91,85 180 top
R65  90,49 0 top
R66  90,19 0 top
R67  100,85 90 bottom
R68  90,24 0 top
R69  26,49 0 top
R70  40,43 0 top
R71  26,30 0 top
R72  40,37 0 top
R73  26,11 0 top
R74  40,17 0 top
RES-1  30,60 0 bottom
RES-2  30,40 0 bottom
RES-3  30,20 0 bottom
U$2  [MOUNTING_HOLE]  8.34,3.11 90 top
U$3  [MOUNTING_HOLE]  103.9,3.11 90 top
U$4  [MOUNTING_HOLE]  103.9,125.63 90 top
U$5  [MOUNTING_HOLE]  7.34,125.63 90 top
V-OCT  100,60 0 bottom
V-OCT1  100,40 0 bottom
V-OCT2  100,20 0 bottom

### Tracks (layer width: path | path; a pad name or v marks a point on that pad's centre or on a via)
5V  (via drill 0.4)  (2 unrouted)
  Top 0.406: 27.04,27.72 27.04,29.96 R71.2 | 27.04,27.72 27.04,25.49 29.37,23.15 29.47,23.15 31.81,20.81 31.81,14.21 28.66,11.06 27.04,11.06 R73.2 | 27.04,27.72 45.53,27.72 51.01,33.21 52.44,33.21 | 32.22,118.04 31.81,117.64 IC4.8 | 32.22,118.04 32.42,118.25 41.77,118.25 42.07,117.94 42.07,116.01 39.94,113.88 36.08,113.88 R32.2 | v31.81,49.06 27.04,49.06 R69.2 | 32.22,118.04 29.98,120.28 16.37,120.28 14.74,118.65 14.74,113.07 15.45,112.35 15.45,106.97 23.68,98.74 23.68,83.3 32.62,74.36 32.62,61.35 40.65,53.33 52.44,53.33
  Bottom 0.406: v31.81,49.06 48.27,49.06 48.58,49.36 | 52.44,53.22 48.58,49.36 | 52.64,33.41 52.64,39.91 54.98,42.25 54.98,42.96 48.58,49.36
10V  (via drill 0.4)
  Top 0.406: IC4.7 31.81,112.35 33.23,110.93 37.91,110.93 41.87,114.89 44.92,114.89 R31.2 45.12,114.79 v62.09,114.79 | v77.63,37.07 77.63,40.83 77.53,40.93 77.53,53.22 R5-F1.P$1 | v73.77,80.86 73.77,76.79 71.64,74.66 71.64,74.25 v70.42,73.03
  Bottom 0.406: R62-F3.P$1 77.43,13.4 77.43,15.22 68.79,23.86 68.79,25.08 69.4,25.69 77.73,25.69 77.94,25.49 78.55,25.49 79.16,26.1 79.16,31.58 77.53,33.21 R1-F2.P$1 77.63,33.41 v77.63,37.07 | v62.09,114.79 71.54,105.34 71.54,83.09 v73.77,80.86 | v70.42,73.03 69.71,73.03 68.9,72.22 68.9,61.86 77.43,53.33 R5-F1.P$1
12V  (via drill 0.4)
  Top 0.406: v76.11,27.42 77.63,28.94 77.94,28.94 C29.1 | v66.66,32.19 68.18,32.19 68.49,31.89 IC1.4 | 60.77,76.29 58.73,76.29 57.52,75.07 C5.1 57.31,74.97 56.91,74.56 v56.2,74.56 | 60.77,76.29 61.99,75.07 C25.1 | v62.9,78.93 62.9,78.42 60.77,76.29 | v17.99,31.79 17.99,24.06 C27.1 | v17.99,33.41 17.99,35.75 18.91,36.66 18.91,40.22 18.2,40.93 17.49,40.93 IC7.4 | v2.04,76.49 1.64,76.08 1.64,75.07 C3.1 | D1.C 3.06,106.06 3.06,107.07 1.94,108.19 1.94,110.63 2.75,111.44 9.66,111.44 10.88,110.22 10.88,110.02 R1.2 11.08,109.92 v12.71,109.92 | v17.59,107.68 18.81,106.46 C13.+ 19.01,106.46 22.77,106.46 27.95,111.64 27.95,112.35 IC4.4 28.05,111.54 31.51,108.09 36.89,108.09 C31.1 37.09,108.09 37.91,108.9 37.91,109 38.21,109.31 42.68,109.31 43.9,108.09 C1.1 43.7,108.49 49.19,113.98 53.15,113.98 53.96,113.17 53.96,112.46 IC9.4 54.06,112.25 v54.06,110.63
  Bottom 0.406: v76.11,27.42 67.98,27.42 65.75,29.65 65.75,31.28 v66.66,32.19 66.56,32.29 66.56,41.23 58.94,48.85 58.94,57.59 57.31,59.22 57.31,73.44 v56.2,74.56 50.71,74.56 46.54,78.72 46.03,78.72 IC2.14 | 64.42,80.45 72.96,80.45 74.59,78.83 74.99,78.83 IC6.14 | v62.9,78.93 64.42,80.45 | v17.99,33.41 17.99,32.9 | 17.99,32.9 v17.99,31.79 | 2.86,76.49 12.71,76.49 14.95,78.72 IC5.14 15.15,78.93 15.15,105.24 v17.59,107.68 15.35,109.92 v12.71,109.92 | 2.86,76.49 v2.04,76.49 | 17.99,32.9 9.46,32.9 2.86,39.51 2.86,76.49 | v54.06,110.63 56.5,108.19 56.5,105.24 64.32,97.42 64.32,80.55 64.42,80.45
-5V  (via drill 0.4)
  Top 0.406: R28.1 18.91,117.03 18.91,117.23 17.89,118.25 16.17,118.25 15.96,118.04 15.96,116.01 19.52,112.46 24.09,112.46 IC4.1 24.39,112.35 25.31,112.35 IC4.2 25.51,112.46 25.51,113.17 26.63,114.28 v29.37,114.28 | v38.92,114.79 40.85,116.72 40.85,116.93 R29.1 | v89.01,31.48 89.01,24.06 R68.1 | v89.01,41.54 89.01,42.96 R61.1 | v97.55,48.96 98.97,48.96 R35.1
  Bottom 0.406: v29.37,114.28 29.88,114.79 v38.92,114.79 39.03,114.89 47.25,114.89 50.71,118.35 102.63,118.35 105.27,115.71 105.27,56.68 v97.55,48.96 96.43,48.96 v89.01,41.54 v89.01,31.48
-5VIN  (via drill 0.4)
  Top 0.406: 87.08,113.98 83.02,113.98 IC3.2 | 87.08,113.98 89.01,115.91 R23.2 89.01,116.11 89.01,117.74 v86.47,120.28 | 87.08,113.98 88.91,112.15 88.91,110.02 C11.1 | v17.79,112.96 18.09,112.96 20.23,110.83 25.92,110.83 26.63,111.54 26.63,112.35 IC4.3
  Bottom 0.406: v17.79,112.96 20.43,112.96 27.75,120.28 v86.47,120.28
-12V  (via drill 0.4)
  Top 0.406: R13.2 46.44,81.87 46.44,83.4 48.98,85.94 R17.2 48.98,86.14 48.98,87.87 46.03,90.81 R24.1 45.93,91.02 45.93,91.22 44.92,92.24 43.19,92.24 42.58,91.63 42.58,91.53 | 42.58,91.53 42.58,86.34 37.3,81.06 37.3,78.22 36.18,77.1 36.18,75.07 C6.2 | C2.2 43.9,100.97 39.03,100.97 C32.2 38.92,101.18 37.91,102.19 v37.91,103.92 | v28.05,119.36 28.05,117.64 IC4.11 | v49.49,115.91 53.05,115.91 53.96,116.83 53.96,117.54 IC9.11 | v38.72,91.53 42.58,91.53 | R54.1 70.22,89.29 70.22,89.49 71.23,90.51 72.86,90.51 73.67,89.7 73.67,84.82 78.85,79.64 78.85,74.05 79.16,73.75 86.78,73.75 88,74.97 C26.2 87.89,75.17 87.89,84.01 86.07,85.84 R46.2 85.96,86.04 85.96,88.78 86.37,89.19 86.37,93.56 85.96,93.97 R47.2 85.86,94.17 85.86,96.61 80.27,102.19 80.27,114.59 80.58,114.89 82.31,114.89 83.32,115.91 86.98,115.91 R23.1 86.98,116.11 88.1,117.23 v88.1,117.43 | 14.13,84.11 14.13,83.09 R42.1 | 14.13,84.11 17.28,87.26 18.91,87.26 19.92,86.24 19.92,86.04 R30.2 | 19.92,96.4 19.92,90 R33.2 20.03,89.8 21.96,87.87 21.96,84.11 27.95,78.12 27.95,75.07 C4.2 28.15,74.86 28.15,69.89 29.07,68.97 29.07,65.41 26.53,62.88 26.53,54.14 23.99,51.6 23.99,45.4 24.19,45.2 24.19,41.74 23.48,41.03 IC7.11 22.67,40.93 23.38,40.93 24.19,40.12 24.19,36.76 23.99,36.56 23.99,31.38 | 19.92,96.4 18.5,97.83 C14.- 18.4,98.03 16.57,99.86 3.06,99.86 D2.A 2.86,99.76 1.84,98.74 1.84,93.25 10.88,84.21 14.03,84.21 14.13,84.11 | v66.66,29.96 65.03,31.58 65.03,31.99 C30.2 64.93,31.48 64.53,31.48 63.81,30.77 v49.79,30.77 | v75.5,31.68 73.87,31.68 73.77,31.79 IC1.11 | 23.99,31.38 23.99,25.89 20.03,21.93 20.03,20 C28.2
  Top 0.406: v24.09,31.38 23.99,31.38 | v20.03,96.5 19.92,96.4
  Bottom 0.406: v28.05,119.36 28.05,114.39 36.18,106.26 36.99,106.26 37.91,105.34 | v37.91,103.92 37.91,105.34 | 37.91,105.34 38.01,105.45 38.72,105.45 49.19,115.91 v49.49,115.91 49.59,116.01 77.33,116.01 78.65,117.33 88,117.33 v88.1,117.43 100.59,117.43 102.02,116.01 102.42,116.01 LED2.4 102.63,115.91 102.63,114.08 LED2.1 | v38.72,91.53 38.72,101.89 39.74,102.91 39.74,103.52 39.13,104.12 38.01,104.12 v37.91,103.92 | v66.66,29.96 73.77,29.96 v75.5,31.68 | v49.79,30.77 24.7,30.77 v24.09,31.38 | v37.91,103.92 37.2,103.92 29.78,96.5 v20.03,96.5
-12V-P
  Top 0.203: D2.C 3.06,96.1 3.06,94.68 6.72,91.02 7.12,91.02 POWER.2 7.22,90.92 12.71,90.92 POWER.1
BANDPASS_IN  (via drill 0.4)
  Top 0.203: IC9.7 57.72,112.35 63,107.07 R5.1 63,106.97 63,104.84 50.3,92.14 v49.79,92.14 | v25,62.16 20.33,62.16 20.03,61.86 20.03,59.73 18.09,57.8 18.09,57.08 C19.1 | v63.71,55.97 64.73,56.98 64.93,56.98 C24.1 | v60.06,52.61 60.06,53.12 55.18,58 41.87,58 40.45,59.42 40.04,59.42 38.92,60.54 38.92,60.84 C15.1 38.92,60.95 v37.7,62.16 37.4,62.47 37.4,72.12 39.03,73.75 39.03,75.98 39.33,76.29 39.33,79.13 v41.97,81.77
  Bottom 0.203: v37.7,62.16 v25,62.16 | v63.71,55.97 63.41,55.97 v60.06,52.61 | v49.79,92.14 49.79,91.83 45.32,87.36 45.32,85.13 v41.97,81.77
BANDPASS_OUT1  (via drill 0.4)
  Top 0.203: v44.51,87.46 45.93,86.04 R27.1 | v41.06,87.46 39.63,86.04 C12.- 39.53,85.94 36.69,83.09 v36.69,81.67 | v14.84,38.19 14.84,39.3 15.35,39.81 17.38,39.81 IC7.5
  Bottom 0.203: v41.06,87.46 v44.51,87.46 | v14.84,38.19 15.96,38.19 16.47,38.69 16.47,57.9 16.27,58.1 16.27,58.71 17.59,60.03 22.57,60.03 31.2,51.39 35.37,51.39 39.33,55.36 39.33,75.88 36.79,78.42 36.79,81.57 v36.69,81.67
BANDPASS_OUT2  (via drill 0.4)
  Top 0.203: IC7.2 17.38,43.57 16.77,43.57 14.64,45.7 3.36,45.7 1.03,48.04 1.03,49.87 2.96,51.8 2.96,60.95 R40.1 2.96,61.05 2.04,61.96 2.04,66.94 2.55,67.45 2.55,75.88 2.86,76.19 v2.86,77.4 | v5.19,81.57 4.99,81.77 4.99,83.3 C18.-
  Bottom 0.203: v5.19,81.57 5.19,81.16 2.86,78.83 v2.86,77.4
BANDPASS_OUT3  (via drill 0.4)
  Top 0.203: 69,84.01 66.66,84.01 C23.- | 69,84.01 70.01,84.01 R52.1 | v20.84,38.49 22.57,38.49 IC7.9 | v54.06,42.55 54.27,42.55 v60.36,48.65 | v69.4,75.37 69.4,77.4 69,77.81 69,84.01
  Bottom 0.203: v20.84,38.49 26.02,38.49 30.08,42.55 v54.06,42.55 | v60.36,48.65 60.36,49.46 66.46,55.56 66.46,72.43 v69.4,75.37
FREQ_IN1  (via drill 0.4)
  Top 0.203: R11.2 63.1,38.09 63.1,42.96 R26.1 63,43.06 63,50.78 56.4,57.39 v56.4,60.44
  Bottom 0.203: v56.4,60.44 52.64,64.2 52.64,71.61 50,74.25 46.03,74.25 41.56,78.72 40.95,78.72 IC2.12
FREQ_IN2  (via drill 0.4)
  Top 0.203: R41.1 63.1,22.03 63.1,23.86 64.93,25.69 64.93,25.99 R7.2 64.93,26.1 61.78,29.25 v54.16,29.25 | v8.14,63.38 8.34,63.59 8.34,72.22 7.02,73.54 7.02,75.98 7.22,76.19 7.33,76.19 9.87,78.72 IC5.12 | v8.14,54.44 16.77,45.81 v17.28,45.81
  Bottom 0.203: v8.14,54.44 v8.14,63.38 | v17.28,45.81 17.28,40.93 22.67,35.55 47.86,35.55 v54.16,29.25
FREQ_IN3  (via drill 0.4)
  Top 0.203: R65.2 90.94,49.06 89.11,50.89 89.11,53.93 R53.1 89.01,54.04 88.5,54.54 v87.69,54.54 | v77.33,74.86 78.34,73.85 78.34,73.75 79.36,72.73 80.48,72.73 81.7,71.51 81.7,68.46 v83.42,66.74
  Bottom 0.203: v77.33,74.86 74.48,74.86 70.62,78.72 70.01,78.72 IC6.12 | v83.42,66.74 83.42,63.69 87.69,59.42 v87.69,54.54
GND  (via drill 0.4)
  Top 0.406: 80.07,30.26 80.07,30.87 R1-F2.P$3 | 80.07,30.26 80.07,29.04 C29.2 | 80.07,30.26 76.52,30.26 75.6,29.35 73.77,29.35 IC1.9 | V-OCT1.P1 99.98,34.33 99.98,36.76 V-OCT1.P2 | V-OCT2.P1 99.98,14.31 99.98,16.75 V-OCT2.P2 | IC3.1 81.09,113.88 81.49,113.88 85.35,110.02 86.98,110.02 C11.2 87.08,109.81 88.2,108.7 | 88.2,108.7 99.78,108.7 100.19,109.1 100.19,109.2 100.9,109.92 R4.2 | 88.2,108.7 86.57,107.07 86.57,105.04 IN3.GND | C20.2 82,74.97 85.96,74.97 C26.1 86.07,75.17 86.07,77.61 86.27,77.81 86.27,79.84 83.12,82.99 IN3LEVEL.P$1 | V-OCT.P2 99.98,56.78 99.98,54.44 V-OCT.P1 99.98,54.24 99.78,54.04 91.04,54.04 R53.2 90.84,54.14 90.13,54.85 90.13,54.95 89.62,55.46 84.85,55.46 82.71,53.33 R5-F1.P$3 82.51,53.33 81.09,54.75 76.41,54.75 65.03,43.37 65.03,43.06 R26.2 | C13.- 18.91,109.61 v16.98,109.61 16.88,109.71 16.88,111.85 15.35,113.37 15.35,118.35 15.86,118.86 19.21,118.86 22.06,116.01 28.46,116.01 29.17,116.72 29.17,117.54 IC4.10 | 55.59,110.93 61.48,105.04 IN2.GND | 55.59,110.93 55.28,111.24 55.28,112.35 IC9.5 | C31.2 38.92,107.99 38.92,107.48 36.59,105.14 IN1.GND 36.59,104.94 36.99,104.53 36.99,101.08 C32.1 37.09,100.87 38.21,99.76 | v21.65,99.45 21.65,98.03 C14.+ | v31.81,109 29.27,111.54 29.27,112.35 IC4.5 | 38.21,99.76 44.82,99.76 45.12,100.06 45.12,100.16 45.83,100.87 C2.1 46.03,101.08 46.03,107.99 C1.2 46.24,107.99 52.64,107.99 55.59,110.93 | v31.41,12.58 33.03,10.96 D8.1 | C27.2 20.03,23.96 18.09,22.03 18.09,20 C28.1 17.89,19.9 12.3,14.31 10.07,14.31 OUTPUT2.P1 | RES-1.P1 30.08,54.24 33.03,51.29 33.03,48.96 D5.1 32.93,48.75 32.73,48.75 29.78,45.81 29.47,45.81 28.66,44.99 28.66,43.88 30.9,41.64 31,41.64 31.81,40.83 31.81,36.15 30.08,34.43 RES-2.P1 30.08,34.22 33.03,31.28 33.03,28.94 D6.1
  Top 0.406: R41.2 65.03,22.03 65.03,23.96 66.97,25.89 66.97,28.43 67.78,29.25 IC1.6 68.69,29.25 69.2,29.25 70.01,30.06 70.01,32.29 69.3,33.01 68.59,33.01 IC1.3 68.29,33.11 65.95,33.11 65.85,33.21 64.02,33.21 63,32.19 C30.1 62.9,32.09 58.63,32.09 57.52,33.21 R55-RES2.P$3 | C22.2 68.08,74.97 66.86,73.75 65.14,73.75 64.93,73.95 64.93,74.05 64.02,74.97 C25.2 63.92,74.86 62.8,73.75 61.17,73.75 60.87,74.05 | 60.87,74.05 59.95,74.97 59.55,74.97 C5.2 | C7.2 49.08,74.97 49.9,74.15 49.9,74.05 50.2,73.75 53.15,73.75 57.41,78.01 57.41,82.99 IN2LEVEL.P$1 | v60.77,73.85 60.77,73.95 60.87,74.05 | C6.1 34.05,75.07 34.05,81.47 32.52,82.99 IN1LEVEL.P$1 32.42,83.09 32.42,90.81 38.11,96.5 38.11,99.65 38.21,99.76 | v41.36,75.37 41.06,75.07 40.04,75.07 C10.2 | POWER.8 7.22,98.54 7.22,96.2 POWER.6 7.22,96 7.22,93.56 POWER.4 7.43,93.56 12.61,93.56 POWER.3 | POWER.3 12.81,93.56 12.81,96 POWER.5 12.81,96.2 12.81,98.54 POWER.7 | C9.2 22.06,74.97 26.02,74.97 C4.1 | v12.51,74.97 8.04,74.97 C17.2 | v4.18,73.54 3.67,74.05 3.67,74.97 C3.2 | C9.2 21.85,74.86 21.14,74.15 21.14,74.05 20.84,73.75 16.47,73.75 15.86,73.14 15.86,72.43 16.47,71.82 16.47,70.19 17.18,69.48 18.4,69.48 20.03,71.1 IC5.3 | POWER.3 13.02,93.56 13.22,93.56 15.76,91.02 15.76,89.7 17.59,87.87 20.13,87.87 21.35,86.65 21.35,75.78 21.96,75.17 C9.2
  Bottom 0.406: R62-F3.P$3 82.51,13.4 99.17,13.4 99.98,14.21 V-OCT2.P1 | 100.09,30.57 100.09,26.2 101.81,24.47 101.81,18.58 100.09,16.85 V-OCT2.P2 | 100.09,30.57 100.09,34.22 V-OCT1.P1 | 100.09,30.57 88.71,30.57 86.07,33.21 82.51,33.21 R1-F2.P$3 82.41,33.41 82.41,39.1 81.49,40.02 81.49,52.21 82.41,53.12 R5-F1.P$3 82.41,53.33 82.41,54.44 80.07,56.78 80.07,71 IC6.3 80.17,71.21 80.17,73.95 | 80.17,73.95 80.17,76.79 81.59,78.22 81.59,82.18 82.41,82.99 IN3LEVEL.P$1 82.51,83.19 82.51,83.4 86.47,87.36 86.47,104.94 IN3.GND | LED1.4 12.61,115.91 12.61,114.08 LED1.1 12.71,113.88 v16.98,109.61 21.55,105.04 21.55,99.55 v21.65,99.45 31,99.45 36.48,104.94 IN1.GND 36.08,104.73 v31.81,109 | v31.41,12.58 31.41,12.89 30.08,14.21 RES-3.P1 29.88,14.31 20.03,14.31 | 20.03,14.31 10.07,14.31 OUTPUT2.P1 | 20.03,34.33 29.98,34.33 RES-2.P1 | 20.03,34.33 11.9,34.33 | 11.9,34.33 10.07,34.33 OUTPUT1.P1 | 11.9,34.33 11.9,44.38 10.07,46.21 10.07,54.24 OUTPUT.P1 | 20.03,34.33 20.03,14.31 | R56-RES3.P$3 57.41,13.4 57.41,19.09 57.31,19.19 57.31,33.11 57.41,33.21 R55-RES2.P$3 57.31,33.31 57.31,40.83 57.41,40.93 57.41,53.22 R4-RES1.P$3 57.41,53.43 57.41,58.2 51.11,64.5 51.11,71 IC2.3 51.01,71.21 48.47,73.75 45.73,73.75 44.11,75.37 v41.36,75.37 39.84,76.9 39.84,79.74 39.74,79.84 | 60.77,76.29 60.77,79.74 57.52,82.99 IN2LEVEL.P$1 57.31,82.99 56.91,82.99 54.77,80.86 40.75,80.86 39.74,79.84 | 60.77,76.29 v60.77,73.85 | 39.74,79.84 36.59,82.99 32.52,82.99 IN1LEVEL.P$1 32.32,82.99 31.91,82.99 20.23,71.31 IC5.3 | IC5.3 20.03,71.21 16.27,74.97 v12.51,74.97 11.08,73.54 v4.18,73.54 | RES-1.P1 29.98,54.34 29.98,54.95 20.13,64.81 20.13,71 IC5.3
  Bottom 0.406: 80.17,73.95 72.05,73.95 69.71,76.29 60.77,76.29
N$1  (via drill 0.4)
  Top 0.203: v10.98,46.52 4.48,46.52 2.96,48.04 2.96,48.14 2.14,48.96 R34.1 | v15.66,39 16.88,39 17.38,38.49 IC7.6 17.38,38.39 17.38,37.27 IC7.7
  Bottom 0.203: v10.98,46.52 10.98,46.11 15.66,41.44 v15.66,39
N$2  (via drill 0.4)
  Top 0.203: R17.1 50.91,85.94 50.91,83.81 50.81,83.7 50.81,81.67 53.66,78.83 IC2.17 | R20.1 40.95,66.74 44.41,70.19 44.41,74.66 44.11,74.97 R18.2 44.11,75.07 45.22,76.19 45.32,76.19 47.25,78.12 v47.25,79.84
  Bottom 0.203: v47.25,79.84 47.76,80.35 51.52,80.35 53.05,78.83 53.55,78.83 IC2.17
N$3  (via drill 0.4)
  Top 0.203: 68.49,24.77 68.49,27.93 IC1.7 | 68.49,24.77 68.49,23.66 65.64,20.81 62.29,20.81 62.09,21.02 62.09,23.45 63,24.37 63,25.99 R7.1 | v93.38,24.77 109.33,40.73 109.33,79.44 102.93,85.84 99.17,85.84 90.94,94.07 90.94,94.17 90.13,94.98 R3.2 | 68.49,24.77 v69.71,24.77
  Bottom 0.203: v69.71,24.77 v93.38,24.77
N$4
  Top 0.203: R6.1 105.98,48.96 104.66,48.96 102.12,46.42 86.88,46.42 80.07,53.22 R5-F1.P$2
N$5
  Top 0.203: R2.1 89.01,33.01 85.15,33.01 83.53,34.63 81.39,34.63 80.07,33.31 R1-F2.P$2
N$6
  Top 0.203: D1.A 3.16,109.71 3.16,107.78 7.12,103.82 7.12,101.18 POWER.10 7.22,101.08 12.71,101.08 POWER.9
N$7
  Top 0.203: R9.3 102.63,74.97 105.98,71.61 105.98,69.07 R8.2 105.88,69.07 102.93,69.07 98.77,64.91 98.77,63.69 101.71,60.74 101.71,49.06 | 101.71,49.06 104.15,49.06 105.27,50.17 106.79,50.17 107.91,49.06 R6.2 107.91,48.96 104.86,45.91 85.25,45.91 81.59,42.25 81.59,39.91 77.94,36.26 77.33,36.26 76.62,36.97 71.64,36.97 71.13,36.46 71.13,36.36 69.2,34.43 68.59,34.43 IC1.2 | 101.71,49.06 101,49.06 R35.2
N$8  (via drill 0.4)
  Top 0.203: 66.2,37.93 68.49,35.65 IC1.1 | 66.2,37.93 66.15,37.98 65.03,37.98 R11.1 | v79.97,55.66 83.12,55.66 91.75,64.3 91.75,66.03 91.15,66.63 91.15,74.97 R10.2 | 66.2,37.93 v69,40.73
  Bottom 0.203: v79.97,55.66 78.75,54.44 78.75,50.48 v69,40.73
N$9
  Top 0.203: R71.1 25.11,30.06 25.11,31.89 29.98,36.76 RES-2.P2
N$10
  Top 0.203: R8.1 107.91,68.97 103.44,64.5 100.09,64.5 V-OCT.P3
N$11
  Top 0.203: R34.2 3.97,49.06 3.97,58.1 9.97,64.09 9.97,64.4 OUTPUT.P3
N$12  (via drill 0.4)
  Top 0.203: 90.94,36.87 90.94,37.98 R59.2 | 90.94,36.87 R2.2 | 88.05,37.12 88.3,36.87 90.94,36.87 | 88.05,37.12 88,37.17 88,38.9 90.94,41.84 90.94,42.96 R61.2 91.04,43.06 v91.04,44.79 | v66.76,31.07 67.27,30.57 68.49,30.57 IC1.5 | v81.49,36.76 87.69,36.76 88.05,37.12
  Bottom 0.203: v91.04,44.79 91.04,74.66 102.53,86.14 102.53,94.98 R60.3 | v66.76,31.07 70.52,31.07 77.33,37.88 80.38,37.88 v81.49,36.76
N$13
  Top 0.203: 33.79,113.73 30.59,116.93 30.59,117.54 IC4.9 | 33.79,113.73 35.37,112.15 35.98,112.15 R32.1 | 33.79,113.73 36.99,116.93 39.03,116.93 R29.2
N$14
  Top 0.203: IC2.15 48.47,78.72 46.03,76.29 46.03,75.07 R18.1 46.03,74.97 46.95,74.05 R19.1
N$15
  Top 0.203: R28.2 17.08,116.93 18.91,115.1 29.68,115.1 30.49,114.28 30.49,112.46 IC4.6 30.59,112.35 30.59,111.75 31.91,110.42 38.21,110.42 40.75,112.96 44.92,112.96 R31.1
N$16  (via drill 0.4)
  Top 0.203: R21.2 39.03,92.95 45.93,92.95 48.78,90.1 48.78,89.19 50.81,87.16 51.72,87.16 51.93,86.95 51.93,84.21 51.22,83.5 51.22,82.48 53.35,80.35 54.57,80.35 56.09,78.83 IC2.18 55.79,79.03 53.96,77.2 53.25,77.2 52.64,77.81 52.64,79.23 50.1,81.77 48.37,81.77 R13.1 | v47.36,62.67 45.12,64.91 R19.2 | v51.72,62.67 57.41,62.67 v58.23,63.48
  Bottom 0.203: v51.72,62.67 v47.36,62.67 | v58.23,63.48 58.23,76.69 56.2,78.72 IC2.18
N$17
  Top 0.203: R21.1 36.99,92.95 36.99,86.55 36.48,86.04 C12.+ 36.38,85.94 35.88,85.43 35.88,78.83 IC2.10
N$18
  Top 0.203: C17.1 6,75.07 6,77.4 7.33,78.72 IC5.11
N$19
  Top 0.203: C15.2 41.06,61.05 41.06,63.18 45.93,68.06 45.93,71.1 IC2.5
N$21
  Top 0.203: R39.1 3.06,66.03 3.06,69.38 4.79,71.1 IC5.9
N$23  (via drill 0.4)
  Top 0.203: 48.02,72.58 48.17,72.73 54.06,72.73 55.18,71.61 55.18,68.87 R12.1 | 48.02,72.58 47.56,72.12 47.56,70.19 50.91,66.84 50.91,65.01 C8.2 | 48.02,72.58 v47.76,72.83
  Bottom 0.203: v47.76,72.83 43.19,72.83 41.56,71.21 40.95,71.21 IC2.7
N$24
  Top 0.203: C8.1 52.94,65.01 52.94,66.74 48.58,71.1 IC2.4
N$25
  Top 0.203: R22.1 47.05,61.05 48.88,61.05 51.72,63.89 53.86,63.89 53.96,63.99 53.96,70.8 53.66,71.1 IC2.2
N$26
  Top 0.203: IC2.6 43.39,71.1 39.13,66.84 39.13,65.01 R20.2 39.13,64.91 40.04,63.99 40.04,60.03 40.24,59.83 41.77,59.83 42.89,60.95 45.02,60.95 R22.2
N$27
  Top 0.203: R12.2 60.87,65.01 60.87,66.43 56.2,71.1 IC2.1
N$28
  Top 0.203: R40.2 4.99,61.05 4.99,63.28 7.33,65.62 7.33,71.1 IC5.8
N$29
  Top 0.203: R42.2 15.86,82.99 15.86,82.18 12.51,78.83 IC5.13
N$30
  Top 0.203: C9.1 20.03,75.07 20.03,78.72 IC5.16
N$31
  Top 0.203: 5.55,79.59 4.79,78.83 IC5.10 | 5.55,79.59 8.95,82.99 R14.1 | 5.55,79.59 1.84,83.3 C18.+
N$32
  Top 0.203: C19.2 15.96,57.08 15.96,57.39 12,61.35 12,64.3 11.69,64.6 11.69,69.99 11.49,70.19 11.49,72.22 12,72.73 13.42,72.73 14.95,71.21 IC5.5
N$33  (via drill 0.4)
  Top 0.203: C16.2 21.04,57.08 26.02,62.06 26.02,67.95 R16.1 26.02,68.06 24.19,69.89 24.19,71.61 22.97,72.83 v16.77,72.83
  Bottom 0.203: v16.77,72.83 12.1,72.83 10.47,71.21 9.97,71.21 IC5.7
N$34  (via drill 0.4)
  Top 0.203: v15.66,55.05 21.04,55.05 22.97,56.98 C16.1
  Bottom 0.203: v15.66,55.05 15.66,69.28 17.49,71.1 IC5.4
N$35
  Top 0.203: R38.1 17.99,61.05 17.99,63.08 22.57,67.65 22.57,71.1 IC5.2
N$36
  Top 0.203: R38.2 16.06,61.05 16.06,62.37 17.89,64.2 17.89,64.91 R37.2 17.99,65.01 12.51,70.5 12.51,71.1 IC5.6
N$37
  Top 0.203: R16.2 27.85,68.06 27.85,68.46 25.21,71.1 IC5.1
N$38  (via drill 0.4)
  Top 0.203: v18.4,59.22 15.86,59.22 15.05,60.03 15.05,61.96 15.96,62.88 15.96,64.91 R37.1 15.86,64.91 v12.51,64.91 | v21.85,59.22 21.85,59.83 22.97,60.95 R36.2 | v20.43,80.96 18.09,83.3 18.09,85.94 R30.1
  Bottom 0.203: v21.85,59.22 v18.4,59.22 | v20.43,80.96 22.57,78.83 IC5.17 22.26,79.03 19.21,75.98 5.5,75.98 3.36,73.85 3.36,73.24 3.87,72.73 5.29,72.73 5.8,72.22 5.8,70.8 11.69,64.91 v12.51,64.91
N$40
  Top 0.203: C7.1 51.01,75.07 51.01,78.72 IC2.16
N$41
  Top 0.203: IC5.15 17.49,78.72 15.15,76.39 15.15,75.07 R15.1 15.05,74.97 13.62,74.97 11.08,72.43 11.08,69.99 11.29,69.78 11.29,62.16 11.59,61.86 11.59,60.74 14.03,58.3 14.03,57.08 15.25,55.87 18.81,55.87 19.01,56.07 19.01,56.98 21.04,59.01 21.04,60.95 R36.1
N$42  (via drill 0.4)
  Top 0.203: 18.25,80.1 18.5,79.84 18.5,76.59 16.98,75.07 R15.2 | 18.25,80.1 17.99,80.35 17.08,80.35 16.57,79.84 16.57,78.42 15.35,77.2 12.1,77.2 10.98,78.32 10.98,82.99 R14.2 | v16.67,90 17.99,90 R33.1 | v19.21,81.06 18.25,80.1
  Bottom 0.203: v16.67,90 16.67,87.26 21.04,82.89 | 21.04,82.89 25.11,78.83 IC5.18 | 21.04,82.89 v19.21,81.06
N$43
  Top 0.203: C10.1 38.01,75.07 38.01,78.42 38.31,78.72 IC2.11
N$44
  Top 0.203: R25.1 40.85,57.08 35.88,62.06 35.88,71.1 IC2.9
N$45
  Top 0.203: C22.1 66.05,75.07 66.05,77.4 67.37,78.72 IC6.11
N$46
  Top 0.203: R51.1 65.03,53.02 63.31,54.75 63.21,54.75 62.49,55.46 62.49,68.77 64.83,71.1 IC6.9
N$47
  Top 0.203: R52.2 71.94,83.91 71.94,80.25 70.93,79.23 70.93,74.66 67.47,71.21 IC6.8
N$48
  Top 0.203: R54.2 72.15,89.19 72.15,85.73 72.96,84.92 72.96,79.23 72.55,78.83 IC6.13
N$49
  Top 0.203: C20.1 80.07,75.07 80.07,78.72 IC6.16
N$50
  Top 0.203: R43.1 63.1,92.95 63.1,84.21 63.31,84.01 C23.+ 63.41,83.91 64.83,82.48 64.83,78.83 IC6.10
N$51
  Top 0.203: R27.2 44.11,85.94 44.11,80.15 44.41,79.84 44.41,77.3 38.31,71.21 IC2.8
N$52
  Top 0.203: C24.2 67.07,57.08 68.49,57.08 76.11,64.7 76.11,70.09 75.09,71.1 IC6.5
N$53  (via drill 0.4)
  Top 0.203: R45.1 88.81,65.21 81.8,65.21 81.09,65.92 C21.2 80.99,66.03 80.99,66.84 79.16,68.67 v79.16,69.17
  Bottom 0.203: v79.16,69.17 72.55,69.17 70.62,71.1 70.01,71.1 IC6.7
N$54
  Top 0.203: R24.2 44,90.92 44,88.07 43.09,87.16 43.09,79.13 43.39,78.83 IC2.13
N$55
  Top 0.203: R10.1 92.97,74.97 97.44,74.97 R9.1 97.55,74.97 99.98,74.97 R9.2
N$56
  Top 0.203: C21.1 78.95,66.03 78.95,68.26 77.63,69.58 77.63,71.1 IC6.4
N$57  (via drill 0.4)
  Top 0.203: v80.99,63.38 76.21,63.38 67.98,55.15 63.41,55.15 62.9,55.66 62.9,56.88 66.05,60.03 66.05,60.13 66.86,60.95 R50.1
  Bottom 0.203: v80.99,63.38 82.61,65.01 82.61,71.1 IC6.2
N$58
  Top 0.203: R50.2 65.03,61.05 65.03,64.91 R49.2 65.03,65.01 66.15,66.13 66.76,66.13 71.74,71.1 72.45,71.1 IC6.6
N$59
  Top 0.203: R45.2 90.64,65.21 90.64,65.72 85.25,71.1 IC6.1
N$60  (via drill 0.4)
  Top 0.203: R49.1 66.97,64.91 70.22,64.91 71.23,63.89 72.86,63.89 73.87,64.91 R48.2 73.97,65.01 v75.3,65.01 | v84.03,83.7 84.03,85.94 R46.1 | v80.99,64.5 v79.16,64.5
  Bottom 0.203: v84.03,83.7 84.03,80.15 82.71,78.83 IC6.17 82.61,78.72 82.61,78.42 81.7,77.51 81.7,70.9 80.99,70.19 v80.99,64.5 | v75.3,65.01 78.65,65.01 v79.16,64.5
N$61
  Top 0.203: R48.1 72.15,65.01 72.15,68.97 73.97,70.8 73.97,74.97 R44.1 74.08,75.07 77.53,78.52 77.53,78.72 IC6.15
N$62  (via drill 0.4)
  Top 0.203: v77.84,76.9 76.01,75.07 R44.2 | IC6.18 85.15,78.83 83.53,80.45 v79.26,80.45 79.26,81.98 78.75,82.48 78.75,88.68 84.03,93.97 R47.1 84.03,94.07 84.03,97.62 75.5,106.16 74.48,106.16 65.03,96.71 65.03,93.05 R43.2
  Bottom 0.203: v77.84,76.9 77.84,77.2 79.16,78.52 79.16,80.35 v79.26,80.45
N$63
  Top 0.203: R57.1 2.45,30.67 3.57,29.55 4.99,29.55 8.75,33.31 8.75,34.73 9.56,35.55 10.47,35.55 15.96,41.03 15.96,41.44 16.77,42.25 17.38,42.25 IC7.3 17.49,42.35 18.09,42.35 18.81,43.06 18.81,43.98 17.99,44.79 17.49,44.79 IC7.1
N$64
  Top 0.203: R57.2 4.28,30.77 4.28,38.69 9.97,44.38 OUTPUT1.P3
N$65
  Top 0.203: 21.91,36.2 22.57,36.87 22.57,37.17 IC7.8 | 21.91,36.2 18.3,32.6 16.37,32.6 4.38,20.61 4.38,10.65 R58.1 | 21.91,36.2 20.03,38.09 20.03,38.8 20.94,39.71 22.57,39.71 IC7.10
N$66
  Top 0.203: R58.2 6.31,10.65 6.31,20.71 9.97,24.37 OUTPUT2.P3
N$67
  Top 0.203: R59.1 89.11,38.09 95.41,44.38 99.98,44.38 V-OCT1.P3
N$68
  Top 0.203: R3.1 91.96,94.98 97.44,94.98 R60.1 97.55,94.98 99.98,94.98 R60.2
N$69  (via drill 0.4)
  Top 0.203: R64.2 90.13,84.92 91.25,83.81 92.36,83.81 100.9,75.27 100.9,74.66 98.26,72.02 98.26,59.32 99.38,58.2 100.39,58.2 101.2,57.39 101.2,53.73 95.31,47.84 90.13,47.84 89.93,48.04 89.93,48.14 89.11,48.96 R65.1 89.22,48.75 v87.69,47.23 | v76.62,29.14 75.5,28.03 73.77,28.03 IC1.8 | v78.04,31.48 78.75,32.19 78.75,35.14 82.41,38.8 v82.41,41.95
  Bottom 0.203: v76.62,29.14 76.62,30.06 v78.04,31.48 | v87.69,47.23 v82.41,41.95
N$70
  Top 0.203: R63.1 89.01,14.01 84.13,14.01 83.53,14.62 81.29,14.62 80.07,13.4 R62-F3.P$2
N$71  (via drill 0.4)
  Top 0.203: 90.94,17.87 90.94,18.98 R66.2 | 90.94,17.87 R63.2 | 88.05,19.95 88,19.9 88,18.17 88.3,17.87 90.94,17.87 | 88.05,19.95 90.94,22.84 90.94,23.96 R68.2 91.04,24.06 91.55,24.06 108.93,41.44 108.93,69.99 102.63,76.29 102.63,84.92 R67.3 | v75.6,30.57 73.77,30.57 IC1.10 | v78.24,26.4 81.59,26.4 88.05,19.95
  Bottom 0.203: v75.6,30.57 75.6,29.04 v78.24,26.4
N$72
  Top 0.203: R66.1 89.11,19.09 94.4,24.37 99.98,24.37 V-OCT2.P3
N$73
  Top 0.203: R64.1 91.96,85.02 97.44,85.02 R67.1 97.55,85.02 99.98,85.02 R67.2
N$74  (via drill 0.4)
  Top 0.203: v98.97,112.46 98.97,110.02 R4.1
  Bottom 0.203: v98.97,112.46 97.44,113.98 LED2.2 97.44,114.08 97.44,115.91 LED2.3
N$75  (via drill 0.4)
  Top 0.203: v7.73,110.53 8.24,110.02 8.95,110.02 R1.1
  Bottom 0.203: v7.73,110.53 7.73,113.67 7.43,113.98 LED1.2 7.43,114.08 7.43,115.91 LED1.3
N$76
  Top 0.203: IN1.TIP 25,104.94 25,93.15 27.44,90.71 27.44,83.09 IN1LEVEL.P$3
N$77
  Bottom 0.203: IN2.TIP 50.1,104.94 50.1,93.15 52.44,90.81 52.44,83.09 IN2LEVEL.P$3
N$78
  Top 0.203: D3.A 43.29,30.06 43.29,36.56 35.47,44.38 30.08,44.38 RES-2.P3
N$79  (via drill 0.4)
  Top 0.203: v64.02,111.64 64.93,112.56 64.93,112.96 R55.2
  Bottom 0.203: v64.02,111.64 49.08,111.64 40.24,102.8 40.24,91.93 32.62,84.31 31.3,84.31 30.08,83.09 IN1LEVEL.P$2
N$80
  Top 0.203: R56.2 71.94,106.97 71.94,105.14 55.08,88.28 55.08,83.09 IN2LEVEL.P$2
N$81
  Top 0.203: R69.1 25.11,49.06 25.11,51.9 29.98,56.78 RES-1.P2
N$82
  Top 0.203: IN3.TIP 75.09,104.94 75.09,93.15 77.43,90.81 77.43,83.09 IN3LEVEL.P$3
N$83  (via drill 0.4)
  Top 0.203: v72.05,108.49 72.05,112.96 R62.2
  Bottom 0.203: v72.05,108.49 72.05,90.92 79.97,82.99 IN3LEVEL.P$2
N$84
  Top 0.203: R62.1 70.01,112.96 70.01,107.17 R56.1 70.01,107.07 65.03,107.07 R5.2 64.93,107.07 63.1,108.9 63.1,112.96 R55.1 63,113.07 62.19,113.88 57.41,113.88 56.6,113.07 56.6,112.46 IC9.6
N$85
  Top 0.203: R72.2 40.85,36.97 40.85,32.19 38.72,30.06 D3.C
N$86
  Top 0.203: D4.A 43.29,50.07 43.09,50.07 30.08,63.08 30.08,64.4 RES-1.P3
N$87
  Top 0.203: R70.2 40.85,43.06 40.85,47.84 38.72,49.97 D4.C
N$88  (via drill 0.4)
  Top 0.203: R70.1 39.03,43.06 34.05,48.04 34.05,51.09 D5.3 34.05,51.19 v35.06,52.21 | v48.58,108.9 49.79,108.9 52.64,111.75 52.64,112.35 IC9.3 | v35.06,83.91 35.06,79.94 34.86,79.74 34.86,76.59 v35.06,76.39
  Bottom 0.203: v48.58,108.9 48.58,97.42 v35.06,83.91 | v35.06,76.39 35.06,73.95 37.4,71.61 37.4,63.69 38.52,62.57 38.52,55.66 v35.06,52.21
N$89  (via drill 0.4)
  Top 0.203: R72.1 39.03,36.97 34.05,31.99 34.05,31.18 D6.3 34.15,31.18 34.35,31.18 37.2,28.33 44.71,28.33 45.02,28.64 45.02,43.37 45.83,44.18 49.19,44.18 51.62,41.74 54.67,41.74 60.16,47.23 v61.78,47.23 | v63.81,49.26 63.81,50.58 62.09,52.31 62.09,67.24 56.6,72.73 55.79,72.73 55.18,73.34 55.18,74.66 61.27,80.76 61.27,93.56 74.28,106.56 75.7,106.56 76.41,105.85 78.65,105.85 79.16,106.36 79.16,115.3 78.24,116.22 77.63,116.22 77.53,116.11 56.2,116.11 55.28,117.03 55.28,117.54 IC9.10
  Bottom 0.203: v61.78,47.23 v63.81,49.26
N$90
  Top 0.203: R73.1 25.11,11.06 25.11,11.87 29.98,16.75 RES-3.P2
N$91
  Top 0.203: D7.A 43.29,11.06 43.29,16.55 35.47,24.37 30.08,24.37 RES-3.P3
N$92
  Top 0.203: R74.2 40.85,16.95 40.85,13.19 38.72,11.06 D7.C
N$93
  Top 0.203: 35.32,13.24 39.03,16.95 R74.1 | 35.32,13.24 35.27,13.19 34.05,13.19 D8.3 | 35.32,13.24 35.77,12.79 35.77,10.86 37.3,9.33 44.71,9.33 50,14.62 60.67,14.62 70.52,24.47 70.52,31.79 73.06,34.33 73.67,34.33 IC1.13
RESONANCE_CTL1  (1 unrouted)
  Top 0.203: 39.13,56.98 39.94,56.17 39.94,56.07 41.36,54.65 53.66,54.65 54.98,53.33 R4-RES1.P$2
RESONANCE_CTL2  (1 unrouted)
RESONANCE_CTL3  (1 unrouted)
RESONANCE_IN1  (via drill 0.4)  (1 unrouted)
  Top 0.203: IC9.2 51.42,112.46 50.2,112.46 IC9.1 50.1,112.35 48.37,112.35 45.02,109 45.02,107.07 41.16,103.21 v38.82,103.21 | v26.22,84.01 26.22,81.57 33.13,74.66 33.13,62.98 39.03,57.08
  Bottom 0.203: v38.82,103.21 38.82,102.8 27.44,91.42 27.44,85.23 v26.22,84.01
RESONANCE_IN2  (via drill 0.4)  (1 unrouted)
  Top 0.203: IC9.8 57.72,117.64 56.6,117.64 IC9.9 56.6,117.74 56.6,118.15 53.96,120.79 15.56,120.79 13.52,118.75 v13.52,102.3 | v6.51,65.92 5.8,65.92 | 5.8,65.92 4.99,65.92 | v13.73,60.74 16.06,58.41 v17.08,58.41 | v46.14,43.37 46.14,41.74 53.25,34.63 53.66,34.63 54.98,33.31 | v7.83,80.76 7.33,80.76 5.8,79.23 5.8,77.81 4.99,77 4.99,73.03 5.8,72.22 5.8,65.92
  Bottom 0.203: v6.51,65.92 6.82,65.92 12,60.74 v13.73,60.74 | v17.08,58.41 21.25,58.41 36.28,43.37 v46.14,43.37 | v13.52,102.3 13.52,86.45 v7.83,80.76
RESONANCE_IN3  (via drill 0.4)  (1 unrouted)
  Top 0.203: v66.97,46.52 66.97,52.92 | v71.94,36.15 73.16,36.15 73.67,35.65 IC1.14 73.77,35.55 74.38,35.55 75.19,34.73 75.19,33.92 74.38,33.11 73.77,33.11 IC1.12 73.67,33.01 73.06,33.01 71.33,31.28 71.33,24.67 58.63,11.97 56.4,11.97 55.08,13.29
  Bottom 0.203: v66.97,46.52 66.97,41.64 71.94,36.66 v71.94,36.15
  Bottom 0.406: 52.54,33.21 55.08,30.67 55.08,21.63 52.54,19.09 52.54,13.4 R56-RES3.P$1

### Text on the board
Bottom: The Queen in Red | Inputs
tNames: -12V
bNames: Triple band pass filter / Design Andy C | CC BY 3.0 | V1.0
bStop: The Queen in Red | Inputs